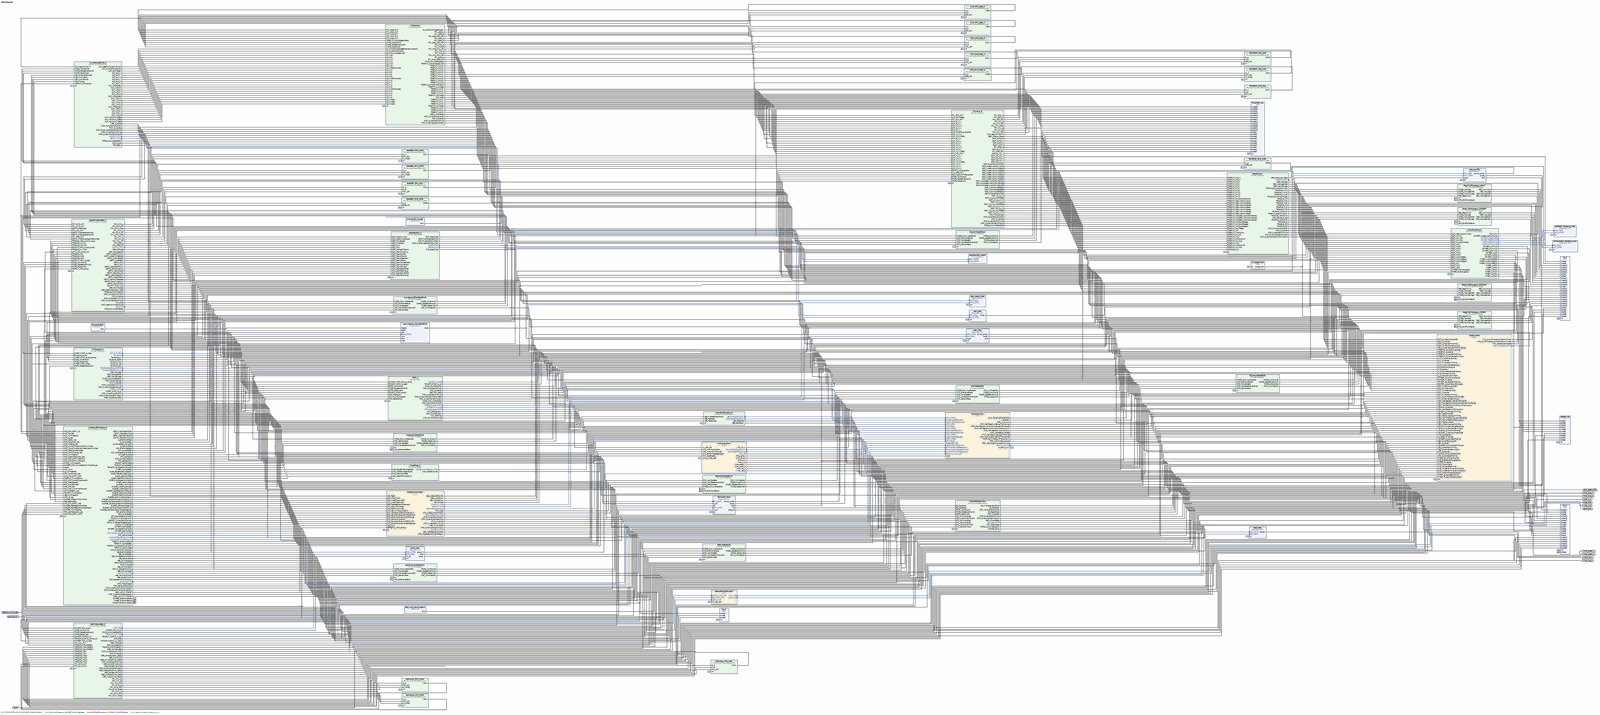
[diagram p0: block diagram of the top level, whole]
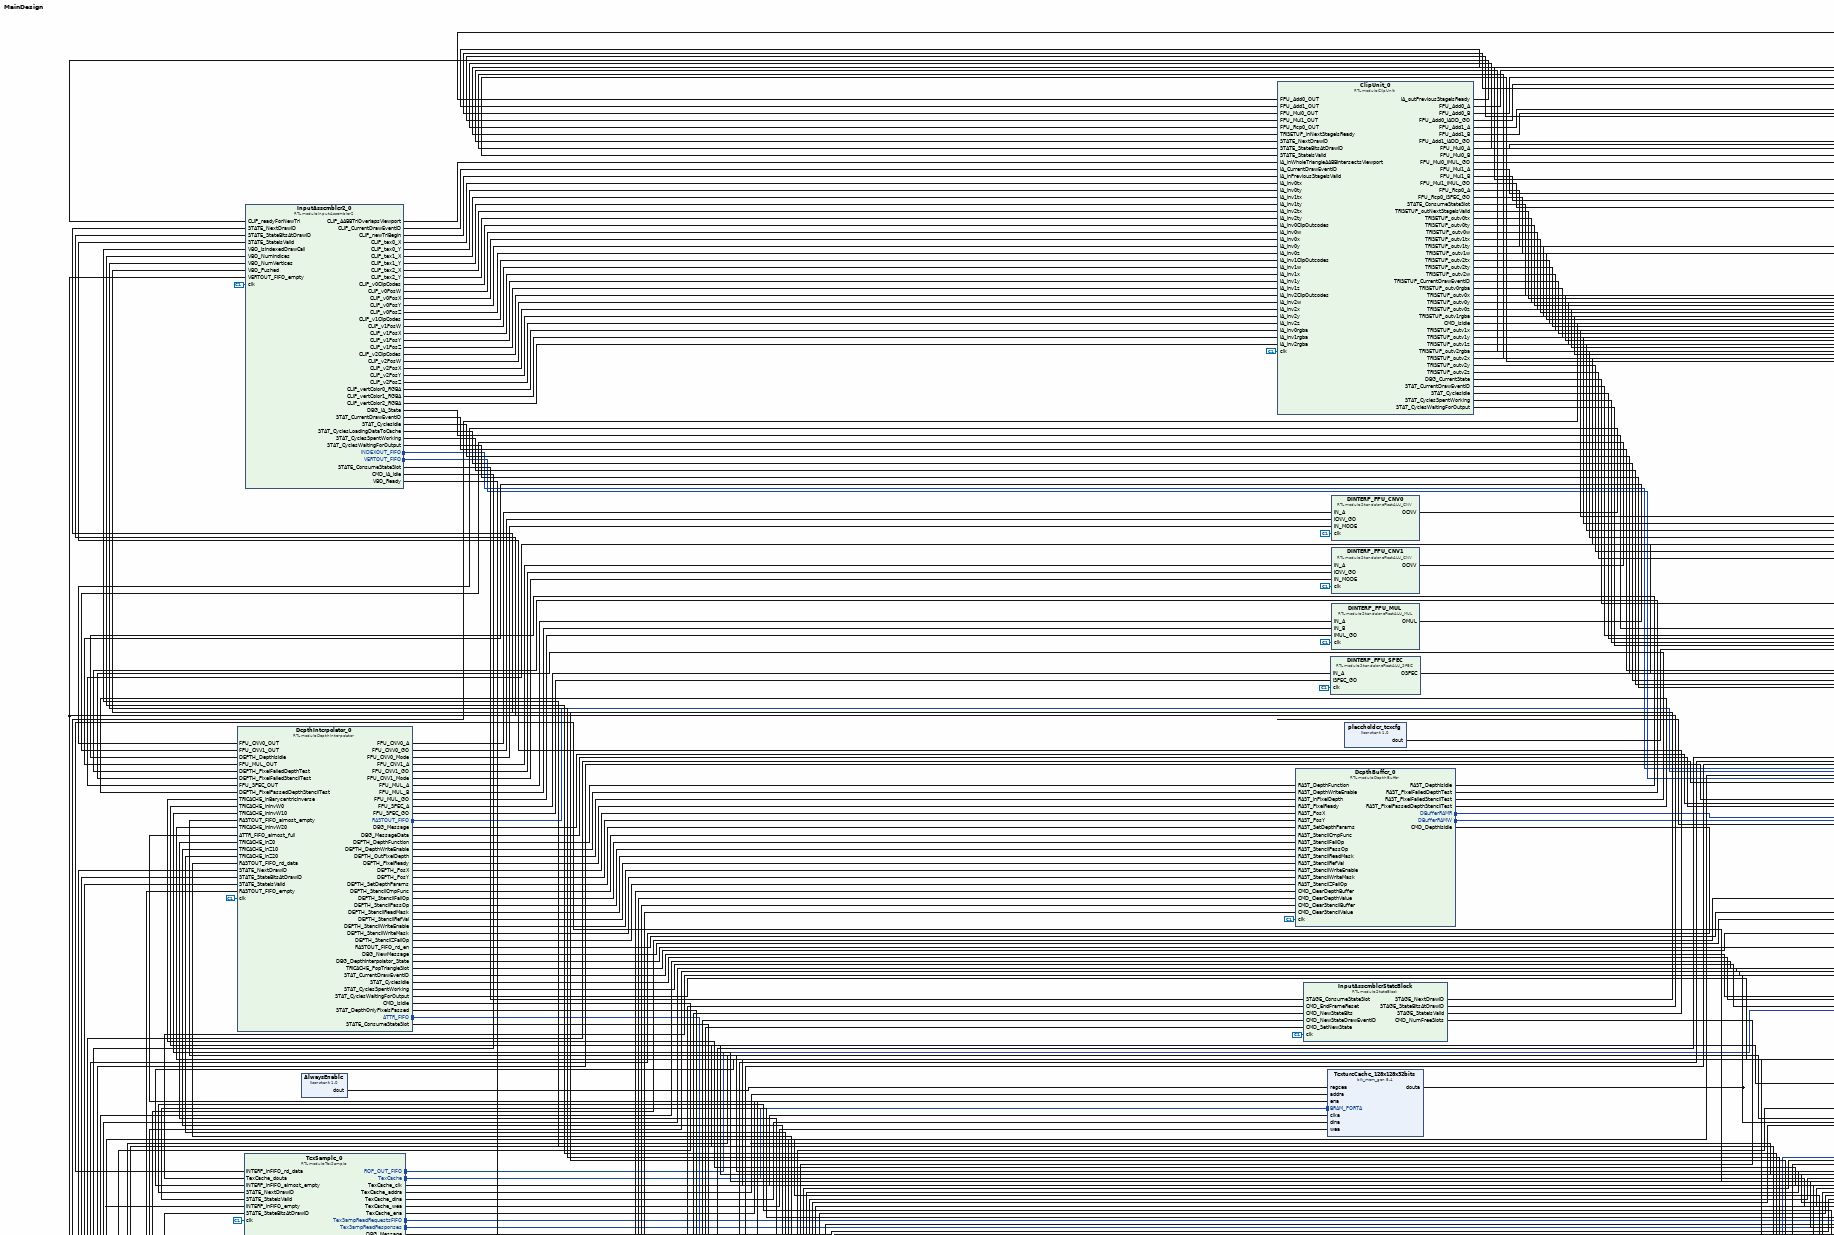
[diagram p1: block diagram of the top level, upper left part]
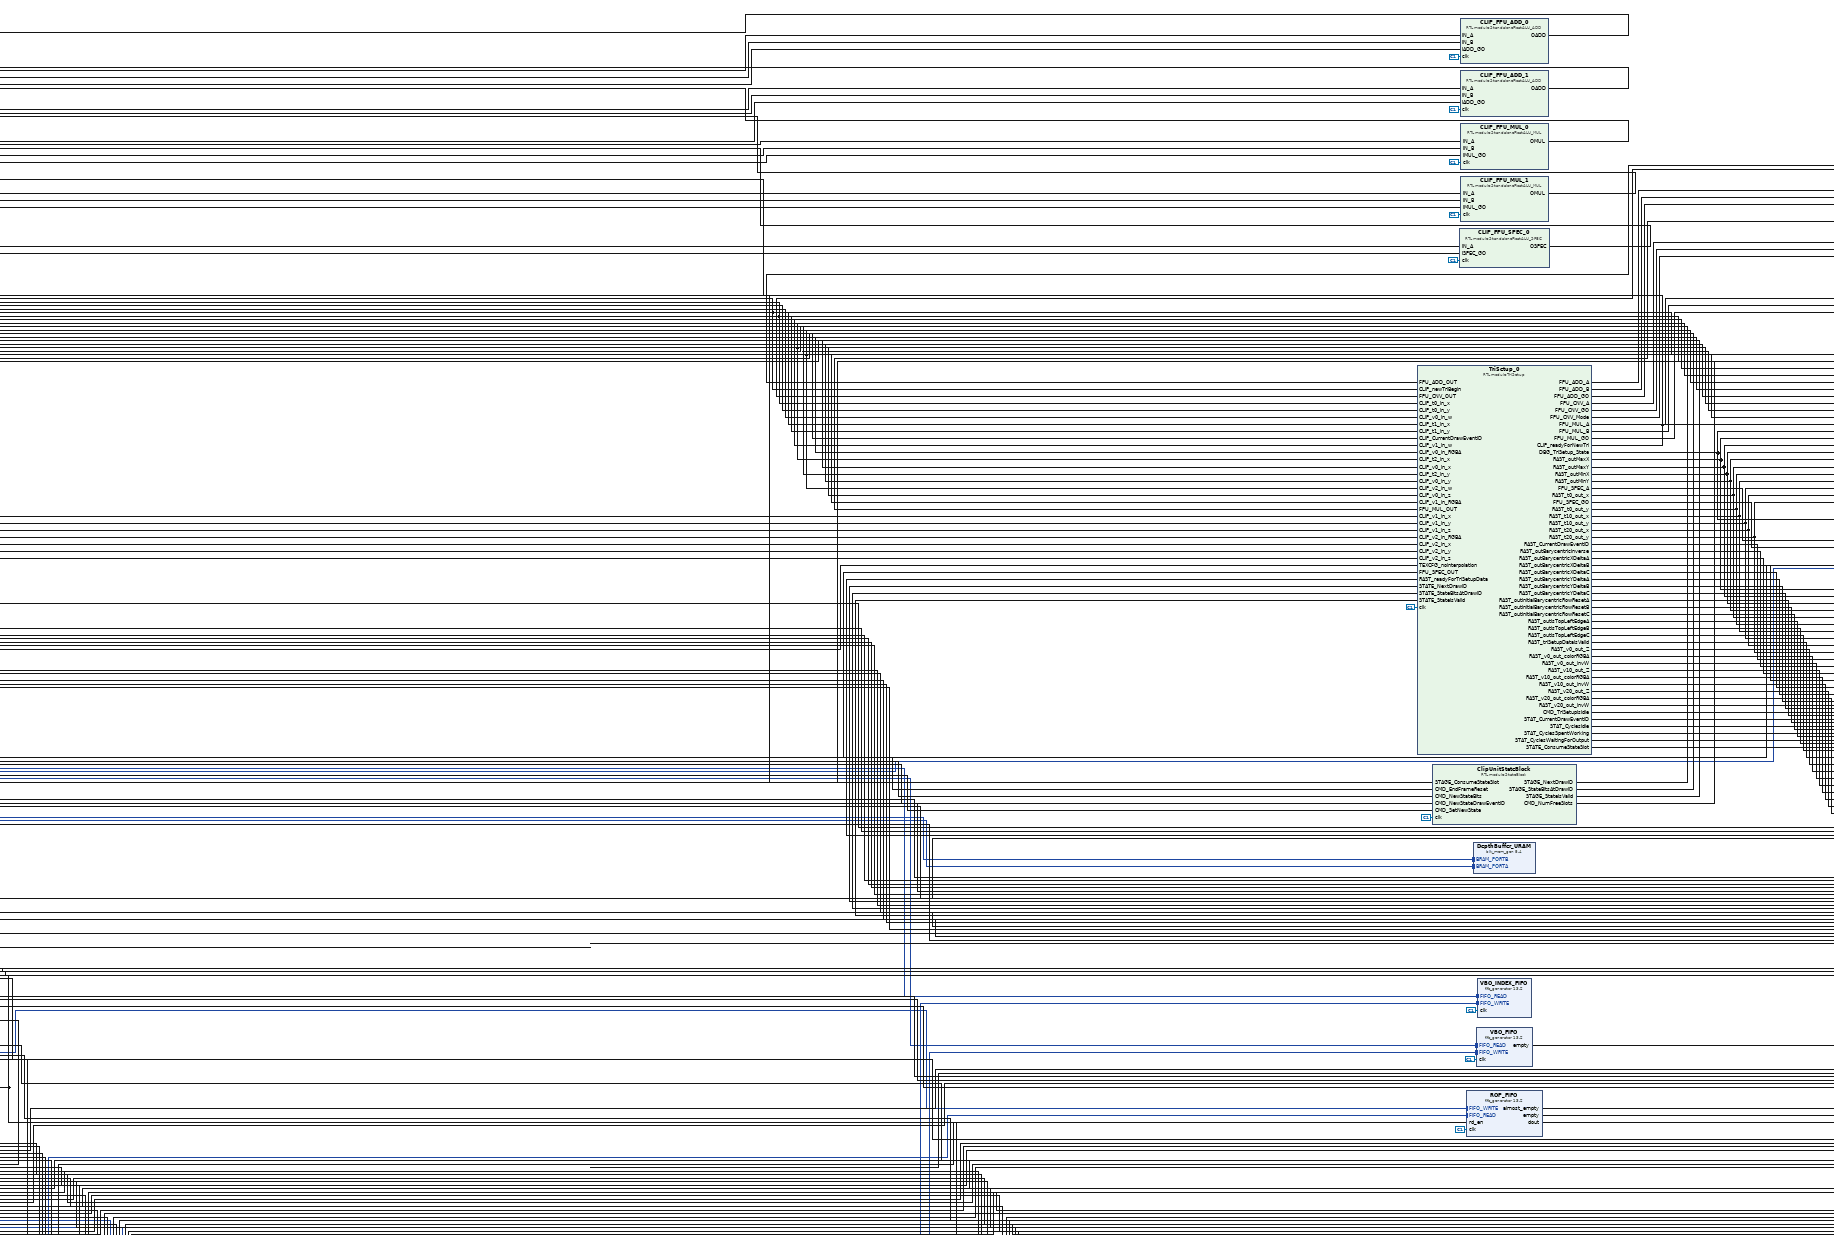
[diagram p2: block diagram of the top level, upper centre part]
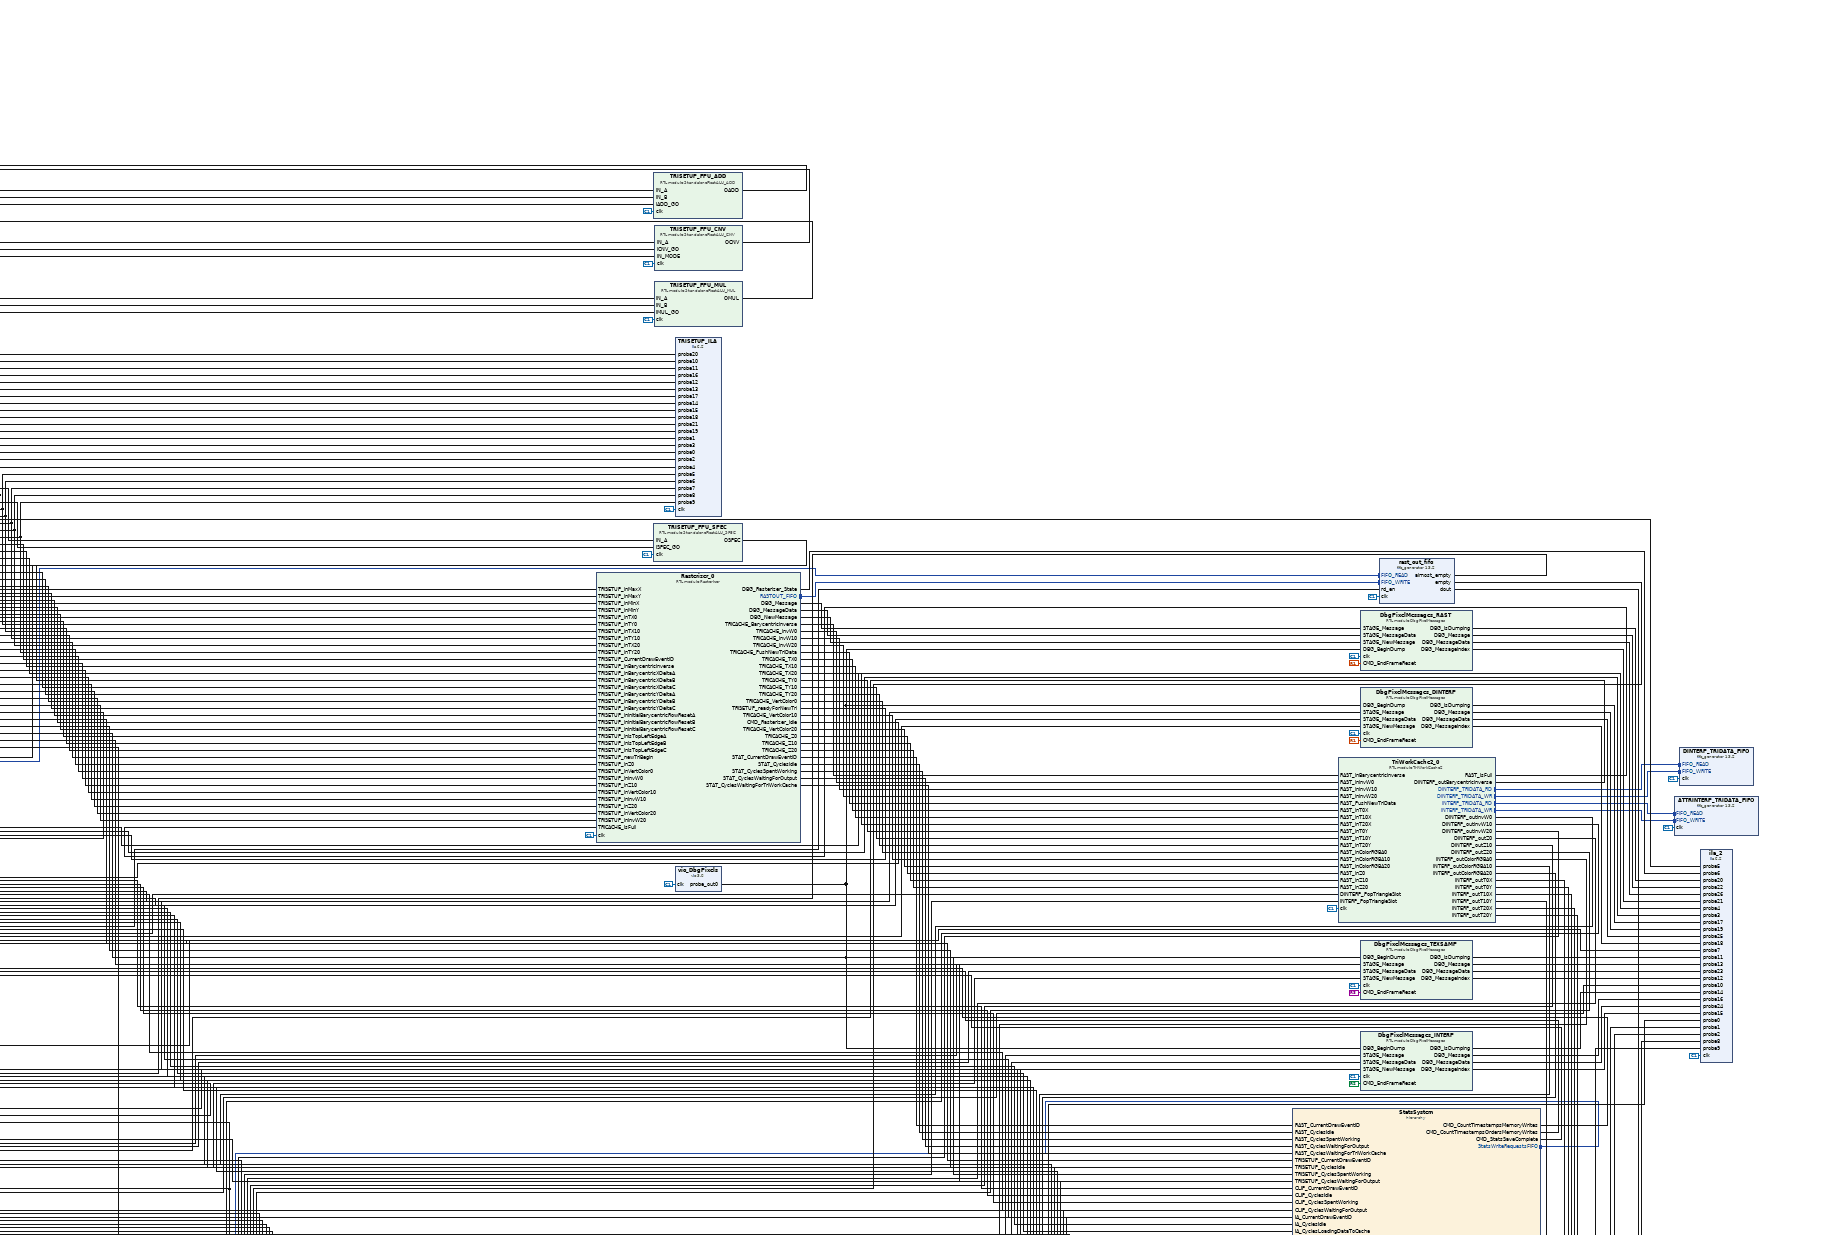
[diagram p3: block diagram of the top level, upper right part]
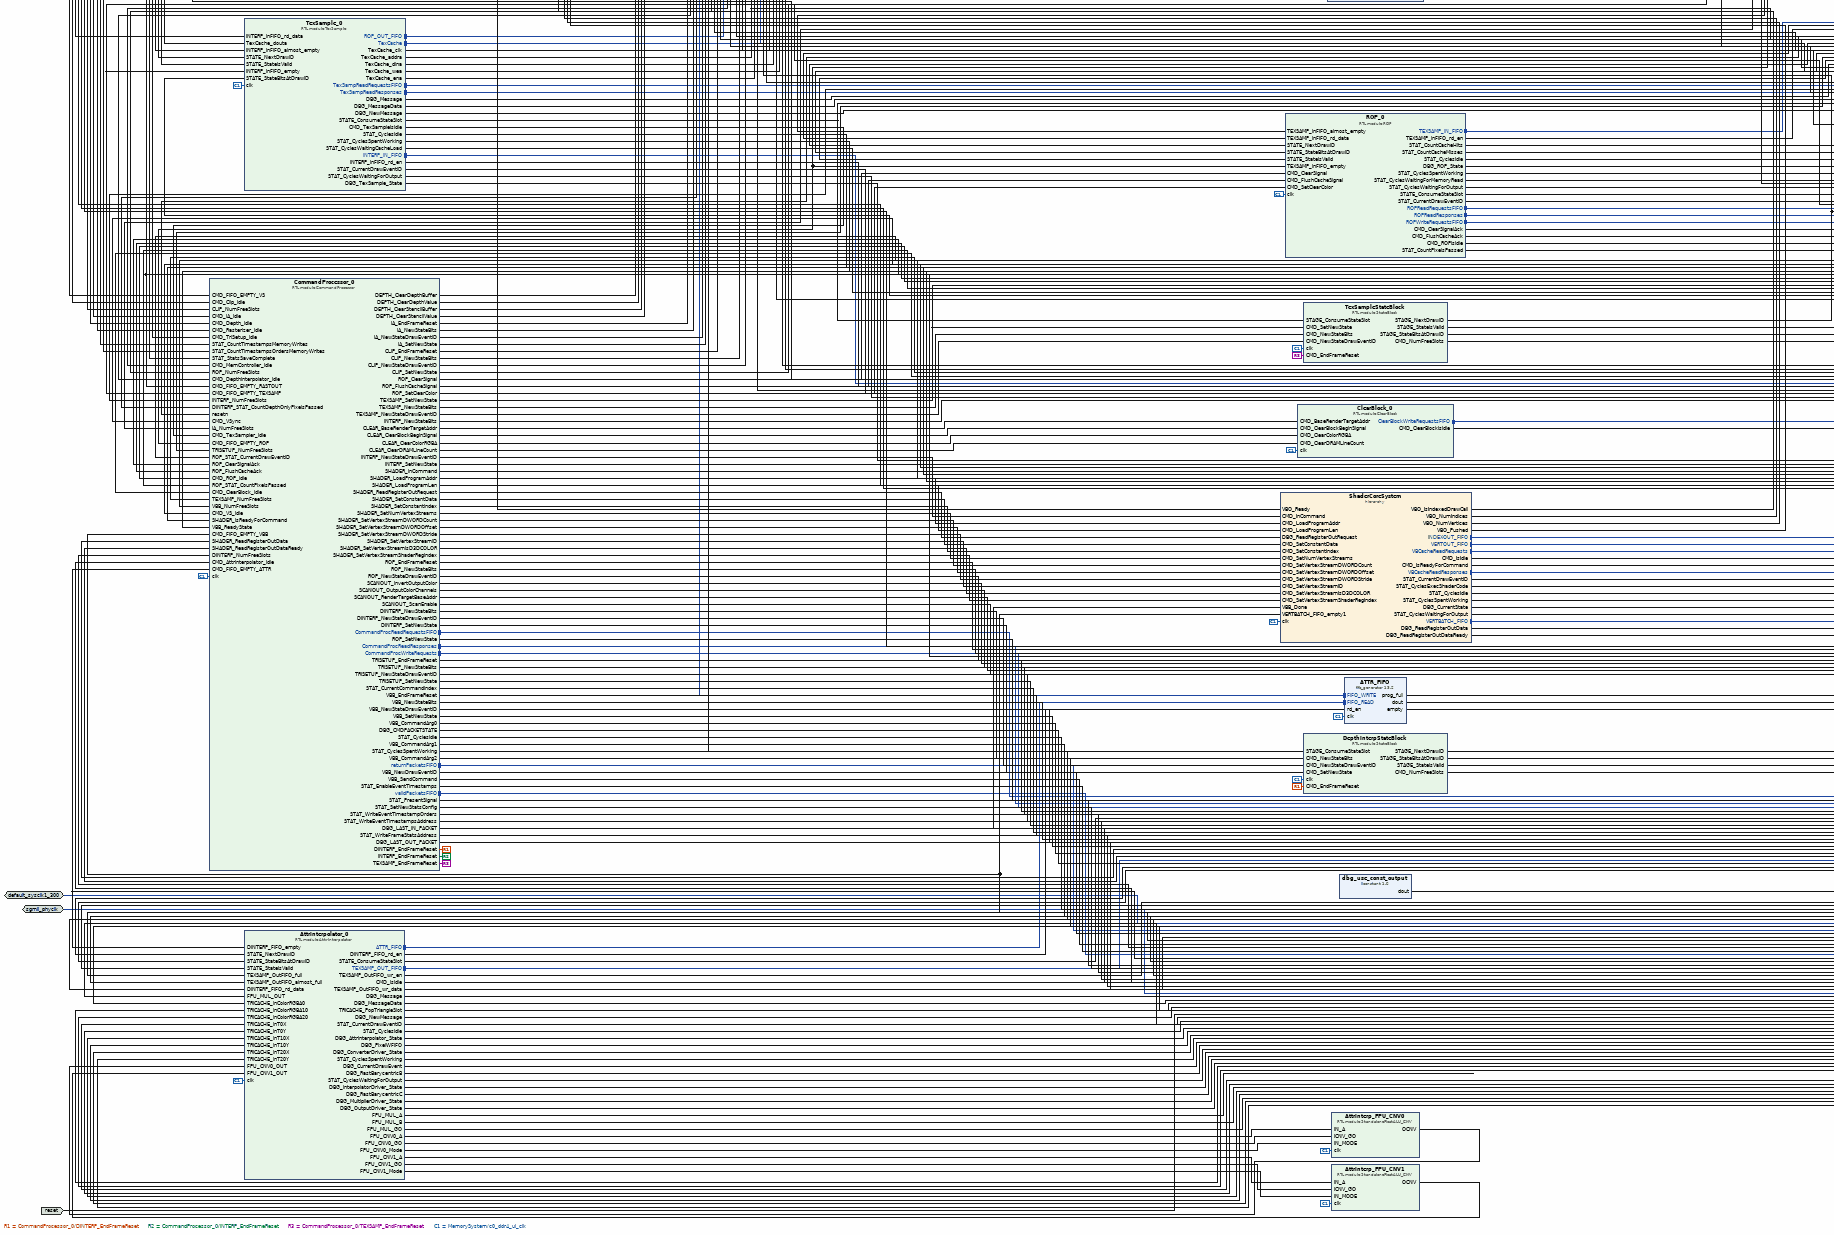
[diagram p4: block diagram of the top level, lower left part]
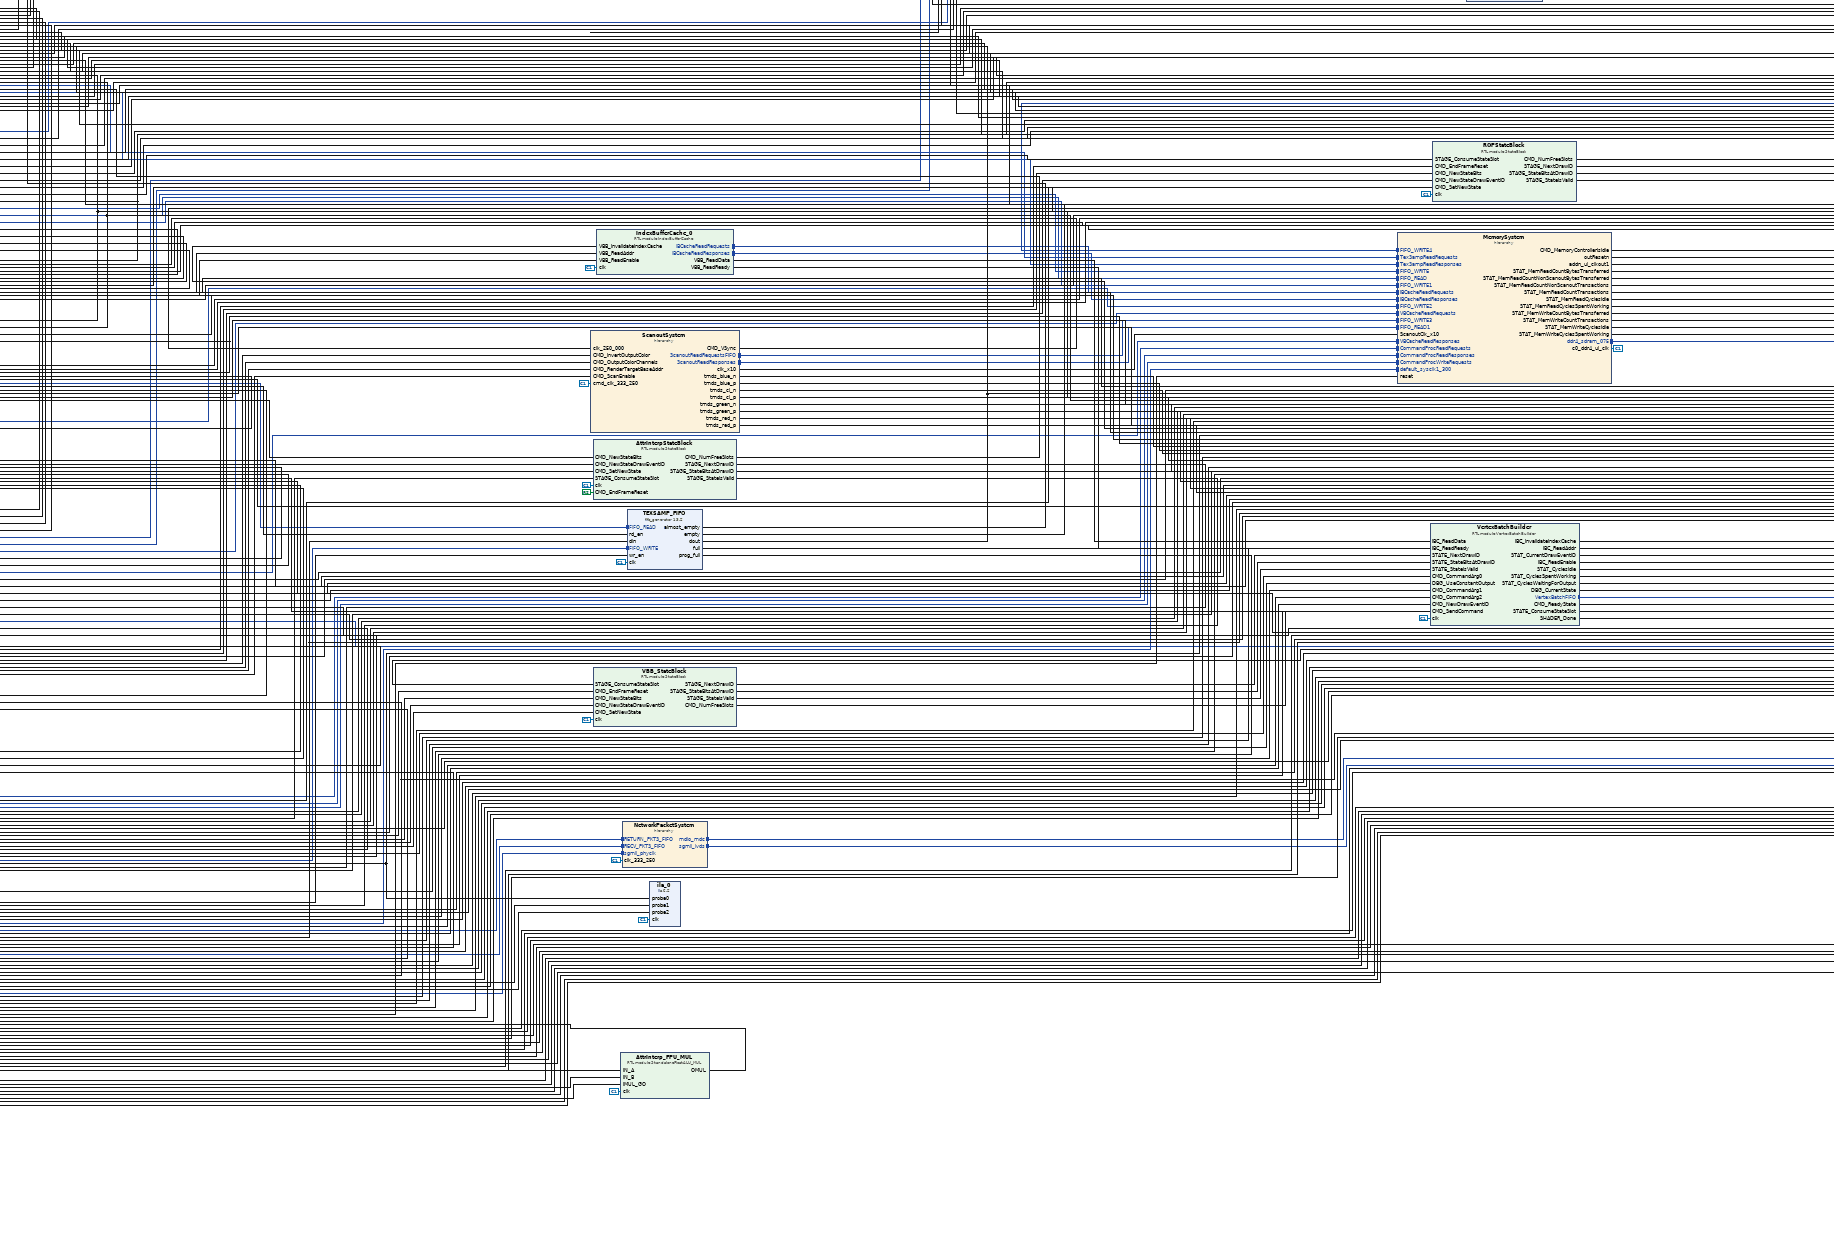
[diagram p5: block diagram of the top level, lower centre part]
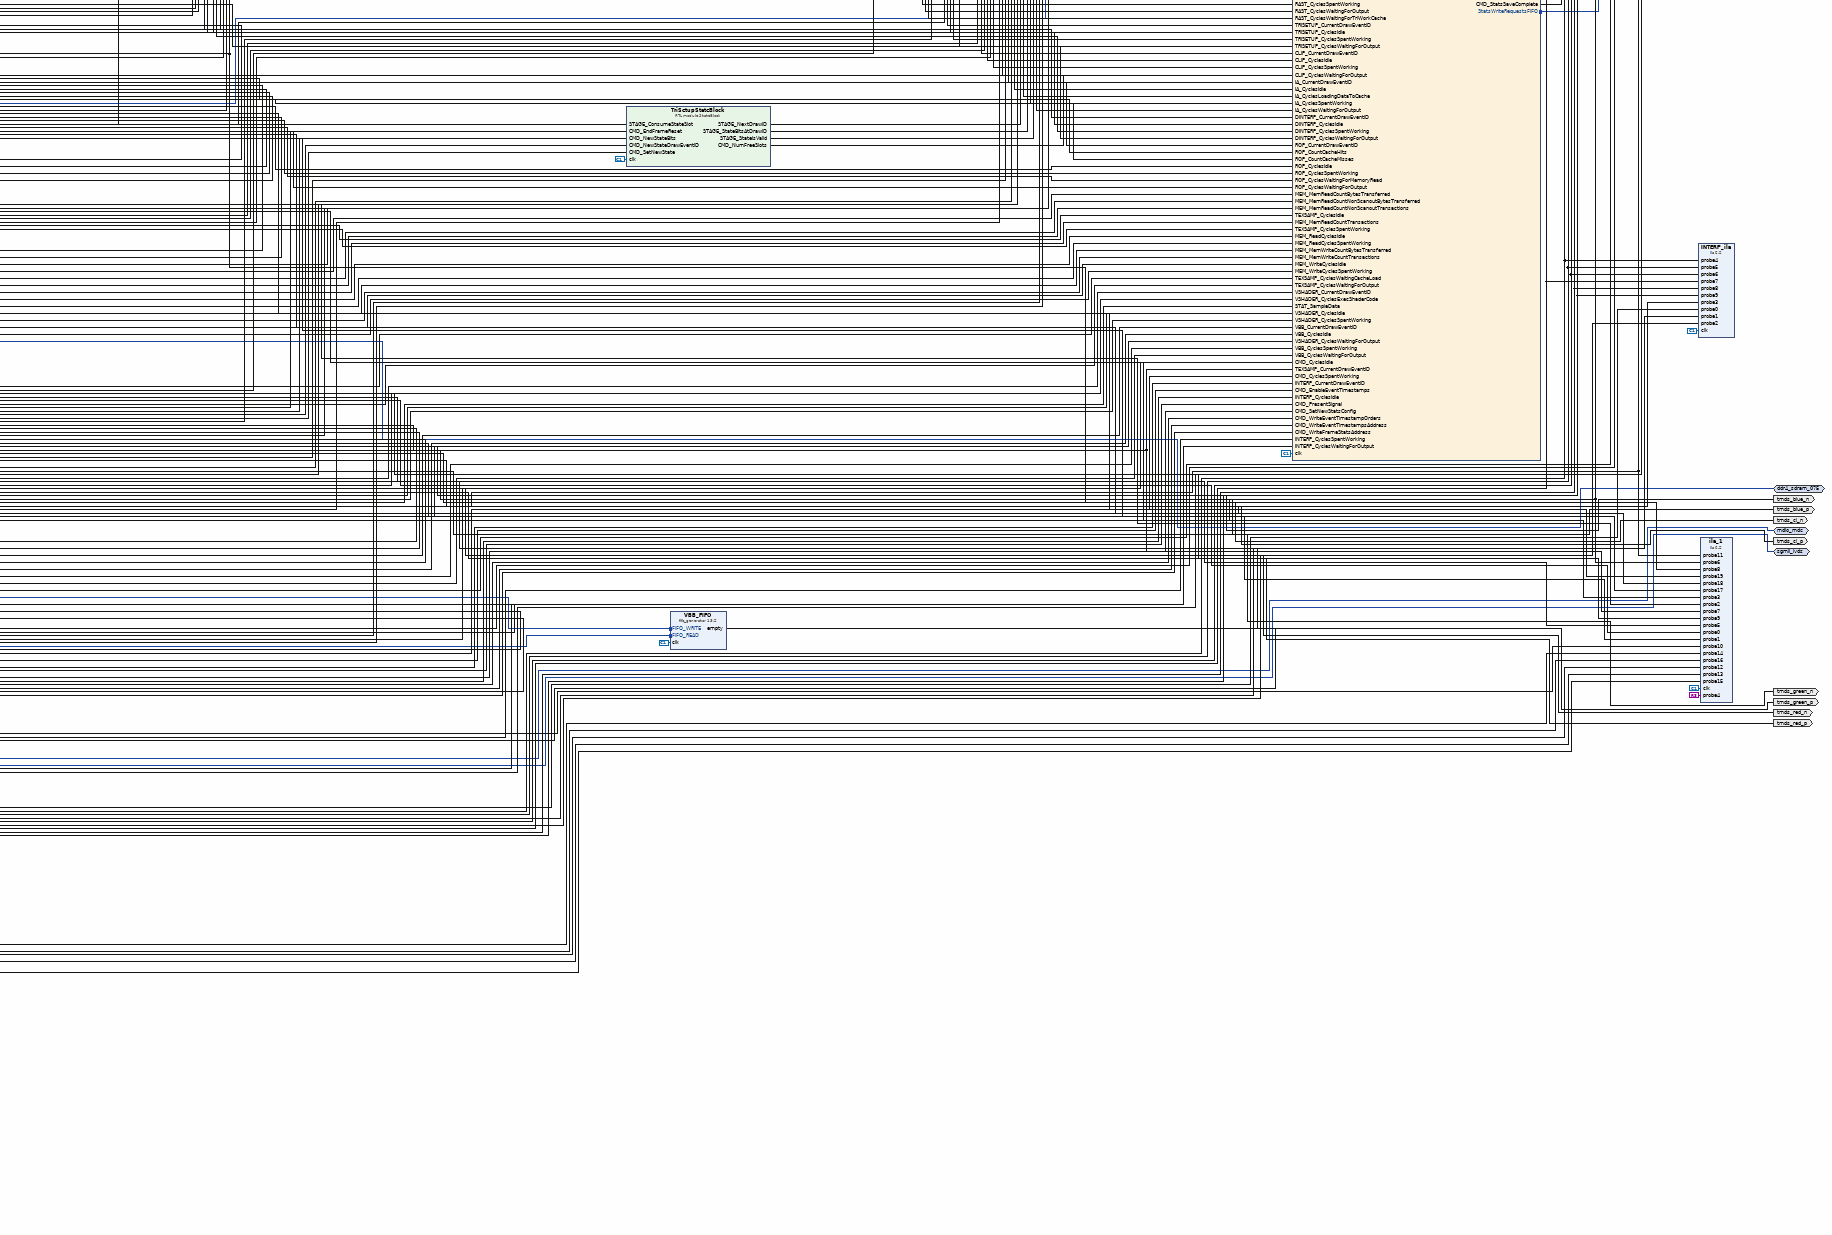
[diagram p6: block diagram of the top level, lower right part]
# Vivado block design MainDesign, xcku5p-ffvb676-2-e, Vivado 2025.2
create_bd_design MainDesign

create_bd_intf_port -mode Slave -vlnv xilinx.com:interface:diff_clock_rtl:1.0 default_sysclk1_300
set_property -dict {CONFIG.FREQ_HZ 300000000} [get_bd_intf_ports default_sysclk1_300]
create_bd_intf_port -mode Master -vlnv xilinx.com:interface:ddr4_rtl:1.0 ddr4_sdram_075
create_bd_intf_port -mode Master -vlnv xilinx.com:interface:mdio_rtl:1.0 mdio_mdc
create_bd_intf_port -mode Master -vlnv xilinx.com:interface:sgmii_rtl:1.0 sgmii_lvds
create_bd_intf_port -mode Slave -vlnv xilinx.com:interface:diff_clock_rtl:1.0 sgmii_phyclk
set_property -dict {CONFIG.FREQ_HZ 625000000} [get_bd_intf_ports sgmii_phyclk]
create_bd_port -dir I -type rst reset
set_property -dict {CONFIG.POLARITY ACTIVE_HIGH} [get_bd_ports reset]
create_bd_port -dir O tmds_blue_p
create_bd_port -dir O tmds_blue_n
create_bd_port -dir O tmds_green_p
create_bd_port -dir O tmds_green_n
create_bd_port -dir O tmds_red_p
create_bd_port -dir O tmds_red_n
create_bd_port -dir O tmds_cl_p
create_bd_port -dir O tmds_cl_n

create_bd_cell -type module -reference CommandProcessor CommandProcessor_0
create_bd_cell -type hier MemorySystem
create_bd_cell -type module -reference VertexBatchBuilder VertexBatchBuilder
create_bd_cell -type module -reference StateBlock VBB_StateBlock
set_property -dict {CONFIG.StateBitsCount 35} [get_bd_cells VBB_StateBlock]
create_bd_cell -type inline_hdl -vlnv xilinx.com:inline_hdl:ilconstant:1.0 dbg_use_const_output
set_property -dict {CONFIG.CONST_VAL 0} [get_bd_cells dbg_use_const_output]
create_bd_cell -type ip -vlnv xilinx.com:ip:fifo_generator:13.2 VBB_FIFO
set_property -dict [list \
  CONFIG.Input_Data_Width 544 \
  CONFIG.Input_Depth 512 \
  CONFIG.Performance_Options First_Word_Fall_Through \
  CONFIG.Use_Embedded_Registers false \
] [get_bd_cells VBB_FIFO]
create_bd_cell -type module -reference IndexBufferCache IndexBufferCache_0
create_bd_cell -type hier ShaderCoreSystem
create_bd_cell -type ip -vlnv xilinx.com:ip:fifo_generator:13.2 VBO_FIFO
set_property -dict [list \
  CONFIG.Input_Data_Width 320 \
  CONFIG.Input_Depth 512 \
  CONFIG.Performance_Options First_Word_Fall_Through \
  CONFIG.Use_Embedded_Registers false \
] [get_bd_cells VBO_FIFO]
create_bd_cell -type ip -vlnv xilinx.com:ip:fifo_generator:13.2 VBO_INDEX_FIFO
set_property -dict [list \
  CONFIG.Input_Data_Width 272 \
  CONFIG.Input_Depth 512 \
  CONFIG.Performance_Options First_Word_Fall_Through \
  CONFIG.Use_Embedded_Registers false \
] [get_bd_cells VBO_INDEX_FIFO]
create_bd_cell -type module -reference InputAssembler2 InputAssembler2_0
create_bd_cell -type module -reference StateBlock InputAssemblerStateBlock
set_property -dict {CONFIG.StateBitsCount 5} [get_bd_cells InputAssemblerStateBlock]
create_bd_cell -type module -reference ClipUnit ClipUnit_0
create_bd_cell -type module -reference StateBlock ClipUnitStateBlock
set_property -dict {CONFIG.StateBitsCount 11} [get_bd_cells ClipUnitStateBlock]
create_bd_cell -type module -reference StandaloneFloatALU_ADD CLIP_FPU_ADD_0
create_bd_cell -type module -reference StandaloneFloatALU_ADD CLIP_FPU_ADD_1
create_bd_cell -type module -reference StandaloneFloatALU_MUL CLIP_FPU_MUL_0
create_bd_cell -type module -reference StandaloneFloatALU_MUL CLIP_FPU_MUL_1
create_bd_cell -type module -reference StandaloneFloatALU_SPEC CLIP_FPU_SPEC_0
create_bd_cell -type module -reference TriSetup TriSetup_0
create_bd_cell -type module -reference StateBlock TriSetupStateBlock
set_property -dict {CONFIG.StateBitsCount 192} [get_bd_cells TriSetupStateBlock]
create_bd_cell -type module -reference StandaloneFloatALU_ADD TRISETUP_FPU_ADD
create_bd_cell -type module -reference StandaloneFloatALU_MUL TRISETUP_FPU_MUL
create_bd_cell -type module -reference StandaloneFloatALU_SPEC TRISETUP_FPU_SPEC
create_bd_cell -type module -reference StandaloneFloatALU_CNV TRISETUP_FPU_CNV
create_bd_cell -type inline_hdl -vlnv xilinx.com:inline_hdl:ilconstant:1.0 placeholder_texcfg
set_property -dict {CONFIG.CONST_VAL 0} [get_bd_cells placeholder_texcfg]
create_bd_cell -type module -reference Rasterizer Rasterizer_0
create_bd_cell -type ip -vlnv xilinx.com:ip:fifo_generator:13.2 rast_out_fifo
set_property -dict [list \
  CONFIG.Almost_Empty_Flag true \
  CONFIG.Almost_Full_Flag true \
  CONFIG.Fifo_Implementation Common_Clock_Block_RAM \
  CONFIG.Input_Data_Width 96 \
  CONFIG.Input_Depth 512 \
  CONFIG.Performance_Options First_Word_Fall_Through \
  CONFIG.Programmable_Full_Type No_Programmable_Full_Threshold \
  CONFIG.Reset_Pin false \
  CONFIG.Use_Embedded_Registers false \
] [get_bd_cells rast_out_fifo]
create_bd_cell -type module -reference TriWorkCache2 TriWorkCache2_0
create_bd_cell -type ip -vlnv xilinx.com:ip:fifo_generator:13.2 DINTERP_TRIDATA_FIFO
set_property -dict [list \
  CONFIG.Input_Data_Width 224 \
  CONFIG.Input_Depth 512 \
  CONFIG.Performance_Options First_Word_Fall_Through \
  CONFIG.Use_Embedded_Registers false \
] [get_bd_cells DINTERP_TRIDATA_FIFO]
create_bd_cell -type ip -vlnv xilinx.com:ip:fifo_generator:13.2 ATTRINTERP_TRIDATA_FIFO
set_property -dict [list \
  CONFIG.Input_Data_Width 576 \
  CONFIG.Input_Depth 512 \
  CONFIG.Performance_Options First_Word_Fall_Through \
  CONFIG.Use_Embedded_Registers false \
] [get_bd_cells ATTRINTERP_TRIDATA_FIFO]
create_bd_cell -type module -reference DepthInterpolator DepthInterpolator_0
create_bd_cell -type module -reference StateBlock DepthInterpStateBlock
set_property -dict {CONFIG.StateBitsCount 77} [get_bd_cells DepthInterpStateBlock]
create_bd_cell -type module -reference StandaloneFloatALU_MUL DINTERP_FPU_MUL
create_bd_cell -type module -reference StandaloneFloatALU_CNV DINTERP_FPU_CNV0
create_bd_cell -type module -reference StandaloneFloatALU_CNV DINTERP_FPU_CNV1
create_bd_cell -type module -reference StandaloneFloatALU_SPEC DINTERP_FPU_SPEC
create_bd_cell -type module -reference DepthBuffer DepthBuffer_0
create_bd_cell -type ip -vlnv xilinx.com:ip:blk_mem_gen:8.4 DepthBuffer_URAM
set_property -dict [list \
  CONFIG.Byte_Size 8 \
  CONFIG.Memory_Type Simple_Dual_Port_RAM \
  CONFIG.Operating_Mode_A WRITE_FIRST \
  CONFIG.PRIM_type_to_Implement URAM \
  CONFIG.READ_LATENCY_B 3 \
  CONFIG.Use_Byte_Write_Enable true \
  CONFIG.Write_Depth_A 153600 \
  CONFIG.Write_Width_A 64 \
  CONFIG.use_bram_block Stand_Alone \
] [get_bd_cells DepthBuffer_URAM]
create_bd_cell -type ip -vlnv xilinx.com:ip:fifo_generator:13.2 ATTR_FIFO
set_property -dict [list \
  CONFIG.Full_Threshold_Assert_Value 450 \
  CONFIG.Input_Data_Width 128 \
  CONFIG.Input_Depth 512 \
  CONFIG.Performance_Options First_Word_Fall_Through \
  CONFIG.Programmable_Full_Type Single_Programmable_Full_Threshold_Constant \
  CONFIG.Use_Embedded_Registers false \
] [get_bd_cells ATTR_FIFO]
create_bd_cell -type module -reference AttrInterpolator AttrInterpolator_0
create_bd_cell -type module -reference StateBlock AttrInterpStateBlock
set_property -dict {CONFIG.StateBitsCount 7} [get_bd_cells AttrInterpStateBlock]
create_bd_cell -type module -reference StandaloneFloatALU_MUL AttrInterp_FPU_MUL
create_bd_cell -type module -reference StandaloneFloatALU_CNV AttrInterp_FPU_CNV0
create_bd_cell -type module -reference StandaloneFloatALU_CNV AttrInterp_FPU_CNV1
create_bd_cell -type ip -vlnv xilinx.com:ip:fifo_generator:13.2 TEXSAMP_FIFO
set_property -dict [list \
  CONFIG.Almost_Empty_Flag true \
  CONFIG.Almost_Full_Flag true \
  CONFIG.Fifo_Implementation Common_Clock_Block_RAM \
  CONFIG.Full_Threshold_Assert_Value 450 \
  CONFIG.Input_Data_Width 96 \
  CONFIG.Input_Depth 512 \
  CONFIG.Performance_Options First_Word_Fall_Through \
  CONFIG.Programmable_Full_Type Single_Programmable_Full_Threshold_Constant \
  CONFIG.Reset_Pin false \
  CONFIG.Use_Embedded_Registers false \
] [get_bd_cells TEXSAMP_FIFO]
create_bd_cell -type module -reference TexSample TexSample_0
create_bd_cell -type ip -vlnv xilinx.com:ip:blk_mem_gen:8.4 TextureCache_128x128x32bits
set_property -dict [list \
  CONFIG.Operating_Mode_A NO_CHANGE \
  CONFIG.PRIM_type_to_Implement BRAM \
  CONFIG.Use_REGCEA_Pin true \
  CONFIG.Use_RSTA_Pin false \
  CONFIG.Write_Depth_A 16384 \
  CONFIG.use_bram_block Stand_Alone \
] [get_bd_cells TextureCache_128x128x32bits]
create_bd_cell -type module -reference StateBlock TexSampleStateBlock
set_property -dict {CONFIG.StateBitsCount 74} [get_bd_cells TexSampleStateBlock]
create_bd_cell -type ip -vlnv xilinx.com:ip:fifo_generator:13.2 ROP_FIFO
set_property -dict [list \
  CONFIG.Almost_Empty_Flag true \
  CONFIG.Almost_Full_Flag true \
  CONFIG.Fifo_Implementation Common_Clock_Block_RAM \
  CONFIG.Input_Data_Width 64 \
  CONFIG.Input_Depth 512 \
  CONFIG.Performance_Options First_Word_Fall_Through \
  CONFIG.Reset_Pin false \
  CONFIG.Use_Embedded_Registers false \
] [get_bd_cells ROP_FIFO]
create_bd_cell -type module -reference ROP ROP_0
create_bd_cell -type module -reference StateBlock ROPStateBlock
set_property -dict {CONFIG.StateBitsCount 101} [get_bd_cells ROPStateBlock]
create_bd_cell -type module -reference ClearBlock ClearBlock_0
create_bd_cell -type hier ScanoutSystem
create_bd_cell -type hier StatsSystem
create_bd_cell -type hier NetworkPacketSystem
create_bd_cell -type ip -vlnv xilinx.com:ip:ila:6.2 ila_0
set_property -dict [list \
  CONFIG.C_MONITOR_TYPE Native \
  CONFIG.C_NUM_OF_PROBES 3 \
  CONFIG.C_PROBE0_WIDTH 8 \
  CONFIG.C_PROBE1_WIDTH 88 \
  CONFIG.C_PROBE2_WIDTH 88 \
] [get_bd_cells ila_0]
create_bd_cell -type ip -vlnv xilinx.com:ip:ila:6.2 ila_1
set_property -dict [list \
  CONFIG.C_MONITOR_TYPE Native \
  CONFIG.C_NUM_OF_PROBES 20 \
  CONFIG.C_PROBE10_WIDTH 128 \
  CONFIG.C_PROBE11_WIDTH 96 \
  CONFIG.C_PROBE12_WIDTH 3 \
  CONFIG.C_PROBE13_WIDTH 3 \
  CONFIG.C_PROBE14_WIDTH 3 \
  CONFIG.C_PROBE15_WIDTH 3 \
  CONFIG.C_PROBE16_WIDTH 16 \
  CONFIG.C_PROBE18_WIDTH 14 \
  CONFIG.C_PROBE19_WIDTH 32 \
  CONFIG.C_PROBE1_WIDTH 3 \
  CONFIG.C_PROBE5_WIDTH 16 \
  CONFIG.C_PROBE6_WIDTH 6 \
  CONFIG.C_PROBE7_WIDTH 16 \
  CONFIG.C_PROBE8_WIDTH 64 \
  CONFIG.C_PROBE9_WIDTH 96 \
] [get_bd_cells ila_1]
create_bd_cell -type ip -vlnv xilinx.com:ip:ila:6.2 ila_2
set_property -dict [list \
  CONFIG.C_MONITOR_TYPE Native \
  CONFIG.C_NUM_OF_PROBES 27 \
  CONFIG.C_PROBE0_WIDTH 8 \
  CONFIG.C_PROBE10_WIDTH 5 \
  CONFIG.C_PROBE12_WIDTH 8 \
  CONFIG.C_PROBE13_WIDTH 16 \
  CONFIG.C_PROBE15_WIDTH 8 \
  CONFIG.C_PROBE16_WIDTH 16 \
  CONFIG.C_PROBE18_WIDTH 8 \
  CONFIG.C_PROBE19_WIDTH 16 \
  CONFIG.C_PROBE1_WIDTH 4 \
  CONFIG.C_PROBE21_WIDTH 8 \
  CONFIG.C_PROBE22_WIDTH 16 \
  CONFIG.C_PROBE23_WIDTH 16 \
  CONFIG.C_PROBE24_WIDTH 16 \
  CONFIG.C_PROBE25_WIDTH 16 \
  CONFIG.C_PROBE26_WIDTH 16 \
  CONFIG.C_PROBE2_WIDTH 6 \
  CONFIG.C_PROBE3_WIDTH 6 \
  CONFIG.C_PROBE4_WIDTH 8 \
  CONFIG.C_PROBE5_WIDTH 8 \
  CONFIG.C_PROBE6_WIDTH 4 \
  CONFIG.C_PROBE7_WIDTH 7 \
  CONFIG.C_PROBE8_WIDTH 3 \
  CONFIG.C_PROBE9_WIDTH 6 \
] [get_bd_cells ila_2]
create_bd_cell -type module -reference DbgPixelMessages DbgPixelMessages_RAST
create_bd_cell -type module -reference DbgPixelMessages DbgPixelMessages_DINTERP
create_bd_cell -type module -reference DbgPixelMessages DbgPixelMessages_INTERP
create_bd_cell -type module -reference DbgPixelMessages DbgPixelMessages_TEXSAMP
create_bd_cell -type ip -vlnv xilinx.com:ip:vio:3.0 vio_DbgPixels
set_property -dict {CONFIG.C_NUM_PROBE_IN 0} [get_bd_cells vio_DbgPixels]
create_bd_cell -type ip -vlnv xilinx.com:ip:ila:6.2 INTERP_ila
set_property -dict [list \
  CONFIG.C_MONITOR_TYPE Native \
  CONFIG.C_NUM_OF_PROBES 10 \
  CONFIG.C_PROBE0_WIDTH 32 \
  CONFIG.C_PROBE1_WIDTH 32 \
  CONFIG.C_PROBE2_WIDTH 32 \
  CONFIG.C_PROBE3_WIDTH 96 \
  CONFIG.C_PROBE4_WIDTH 32 \
  CONFIG.C_PROBE5_WIDTH 32 \
  CONFIG.C_PROBE6_WIDTH 32 \
  CONFIG.C_PROBE7_WIDTH 32 \
  CONFIG.C_PROBE8_WIDTH 32 \
  CONFIG.C_PROBE9_WIDTH 32 \
] [get_bd_cells INTERP_ila]
create_bd_cell -type ip -vlnv xilinx.com:ip:ila:6.2 TRISETUP_ILA
set_property -dict [list \
  CONFIG.C_MONITOR_TYPE Native \
  CONFIG.C_NUM_OF_PROBES 22 \
  CONFIG.C_PROBE0_WIDTH 16 \
  CONFIG.C_PROBE10_WIDTH 32 \
  CONFIG.C_PROBE11_WIDTH 32 \
  CONFIG.C_PROBE12_WIDTH 32 \
  CONFIG.C_PROBE13_WIDTH 32 \
  CONFIG.C_PROBE14_WIDTH 32 \
  CONFIG.C_PROBE15_WIDTH 32 \
  CONFIG.C_PROBE16_WIDTH 32 \
  CONFIG.C_PROBE17_WIDTH 32 \
  CONFIG.C_PROBE18_WIDTH 32 \
  CONFIG.C_PROBE19_WIDTH 8 \
  CONFIG.C_PROBE1_WIDTH 16 \
  CONFIG.C_PROBE2_WIDTH 16 \
  CONFIG.C_PROBE3_WIDTH 16 \
  CONFIG.C_PROBE4_WIDTH 32 \
  CONFIG.C_PROBE5_WIDTH 32 \
  CONFIG.C_PROBE6_WIDTH 32 \
  CONFIG.C_PROBE7_WIDTH 32 \
  CONFIG.C_PROBE8_WIDTH 32 \
  CONFIG.C_PROBE9_WIDTH 32 \
] [get_bd_cells TRISETUP_ILA]
create_bd_cell -type inline_hdl -vlnv xilinx.com:inline_hdl:ilconstant:1.0 AlwaysEnable

# ---- hierarchy /MemorySystem ----
current_bd_instance /MemorySystem
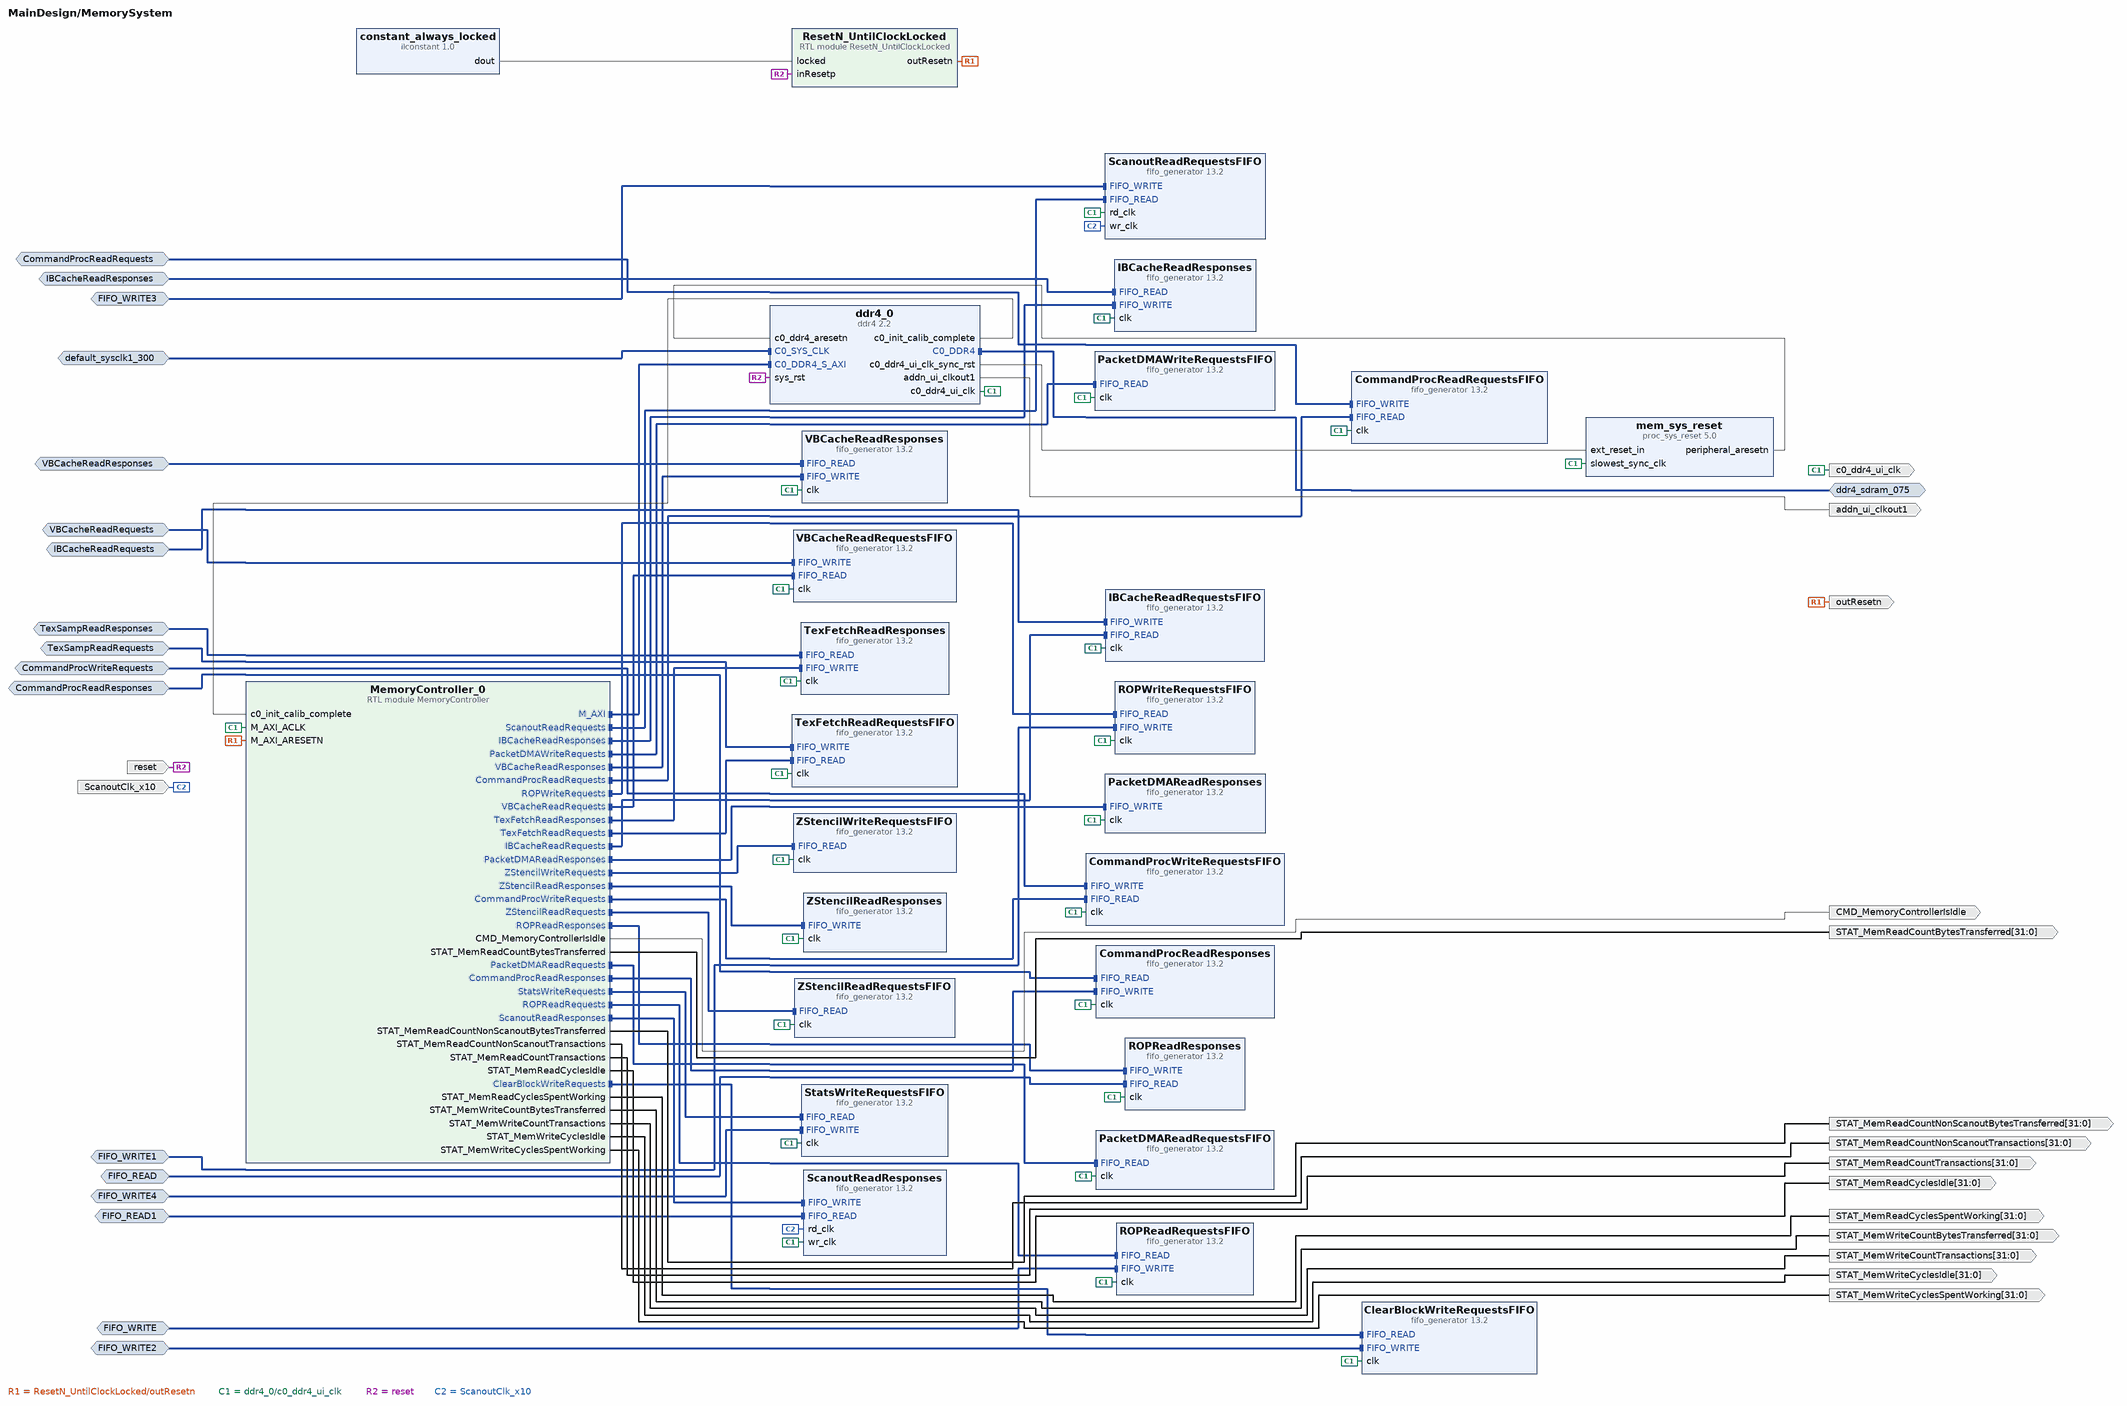
[diagram p7: block diagram inside /MemorySystem]
create_bd_intf_pin -mode Slave -vlnv xilinx.com:interface:fifo_read_rtl:1.0 CommandProcReadResponses
create_bd_intf_pin -mode Slave -vlnv xilinx.com:interface:fifo_write_rtl:1.0 CommandProcReadRequests
create_bd_intf_pin -mode Slave -vlnv xilinx.com:interface:diff_clock_rtl:1.0 default_sysclk1_300
create_bd_intf_pin -mode Master -vlnv xilinx.com:interface:ddr4_rtl:1.0 ddr4_sdram_075
create_bd_intf_pin -mode Slave -vlnv xilinx.com:interface:fifo_write_rtl:1.0 CommandProcWriteRequests
create_bd_intf_pin -mode Slave -vlnv xilinx.com:interface:fifo_write_rtl:1.0 IBCacheReadRequests
create_bd_intf_pin -mode Slave -vlnv xilinx.com:interface:fifo_read_rtl:1.0 IBCacheReadResponses
create_bd_intf_pin -mode Slave -vlnv xilinx.com:interface:fifo_write_rtl:1.0 VBCacheReadRequests
create_bd_intf_pin -mode Slave -vlnv xilinx.com:interface:fifo_read_rtl:1.0 VBCacheReadResponses
create_bd_intf_pin -mode Slave -vlnv xilinx.com:interface:fifo_write_rtl:1.0 TexSampReadRequests
create_bd_intf_pin -mode Slave -vlnv xilinx.com:interface:fifo_read_rtl:1.0 TexSampReadResponses
create_bd_intf_pin -mode Slave -vlnv xilinx.com:interface:fifo_write_rtl:1.0 FIFO_WRITE
create_bd_intf_pin -mode Slave -vlnv xilinx.com:interface:fifo_read_rtl:1.0 FIFO_READ
create_bd_intf_pin -mode Slave -vlnv xilinx.com:interface:fifo_write_rtl:1.0 FIFO_WRITE1
create_bd_intf_pin -mode Slave -vlnv xilinx.com:interface:fifo_write_rtl:1.0 FIFO_WRITE2
create_bd_intf_pin -mode Slave -vlnv xilinx.com:interface:fifo_write_rtl:1.0 FIFO_WRITE3
create_bd_intf_pin -mode Slave -vlnv xilinx.com:interface:fifo_read_rtl:1.0 FIFO_READ1
create_bd_intf_pin -mode Slave -vlnv xilinx.com:interface:fifo_write_rtl:1.0 FIFO_WRITE4
create_bd_pin -dir O -type clk c0_ddr4_ui_clk
create_bd_pin -dir O -type rst outResetn
create_bd_pin -dir O CMD_MemoryControllerIsIdle
create_bd_pin -dir I -type rst reset
create_bd_pin -dir O -type clk addn_ui_clkout1
create_bd_pin -dir I -type clk ScanoutClk_x10
create_bd_pin -dir O -from 31 -to 0 STAT_MemReadCyclesIdle
create_bd_pin -dir O -from 31 -to 0 STAT_MemReadCyclesSpentWorking
create_bd_pin -dir O -from 31 -to 0 STAT_MemWriteCyclesIdle
create_bd_pin -dir O -from 31 -to 0 STAT_MemWriteCyclesSpentWorking
create_bd_pin -dir O -from 31 -to 0 STAT_MemReadCountBytesTransferred
create_bd_pin -dir O -from 31 -to 0 STAT_MemReadCountTransactions
create_bd_pin -dir O -from 31 -to 0 STAT_MemReadCountNonScanoutBytesTransferred
create_bd_pin -dir O -from 31 -to 0 STAT_MemReadCountNonScanoutTransactions
create_bd_pin -dir O -from 31 -to 0 STAT_MemWriteCountBytesTransferred
create_bd_pin -dir O -from 31 -to 0 STAT_MemWriteCountTransactions

create_bd_cell -type ip -vlnv xilinx.com:ip:fifo_generator:13.2 ZStencilReadResponses
set_property -dict [list \
  CONFIG.Fifo_Implementation Common_Clock_Builtin_FIFO \
  CONFIG.Input_Data_Width 256 \
  CONFIG.Input_Depth 512 \
  CONFIG.Performance_Options First_Word_Fall_Through \
  CONFIG.Use_Embedded_Registers true \
] [get_bd_cells ZStencilReadResponses]
create_bd_cell -type ip -vlnv xilinx.com:ip:fifo_generator:13.2 ScanoutReadResponses
set_property -dict [list \
  CONFIG.Fifo_Implementation Independent_Clocks_Builtin_FIFO \
  CONFIG.Input_Data_Width 256 \
  CONFIG.Input_Depth 512 \
  CONFIG.Performance_Options First_Word_Fall_Through \
  CONFIG.Read_Clock_Frequency 250 \
  CONFIG.Use_Embedded_Registers true \
  CONFIG.Write_Clock_Frequency 333 \
] [get_bd_cells ScanoutReadResponses]
create_bd_cell -type ip -vlnv xilinx.com:ip:fifo_generator:13.2 IBCacheReadResponses
set_property -dict [list \
  CONFIG.Fifo_Implementation Common_Clock_Builtin_FIFO \
  CONFIG.Input_Data_Width 256 \
  CONFIG.Input_Depth 512 \
  CONFIG.Performance_Options First_Word_Fall_Through \
  CONFIG.Use_Embedded_Registers true \
] [get_bd_cells IBCacheReadResponses]
create_bd_cell -type ip -vlnv xilinx.com:ip:fifo_generator:13.2 PacketDMAReadRequestsFIFO
set_property -dict [list \
  CONFIG.Fifo_Implementation Common_Clock_Builtin_FIFO \
  CONFIG.Input_Data_Width 30 \
  CONFIG.Input_Depth 512 \
  CONFIG.Performance_Options First_Word_Fall_Through \
  CONFIG.Use_Embedded_Registers true \
] [get_bd_cells PacketDMAReadRequestsFIFO]
create_bd_cell -type ip -vlnv xilinx.com:ip:fifo_generator:13.2 CommandProcReadResponses
set_property -dict [list \
  CONFIG.Fifo_Implementation Common_Clock_Builtin_FIFO \
  CONFIG.Input_Data_Width 256 \
  CONFIG.Input_Depth 512 \
  CONFIG.Performance_Options First_Word_Fall_Through \
  CONFIG.Use_Embedded_Registers true \
] [get_bd_cells CommandProcReadResponses]
create_bd_cell -type ip -vlnv xilinx.com:ip:fifo_generator:13.2 ZStencilReadRequestsFIFO
set_property -dict [list \
  CONFIG.Fifo_Implementation Common_Clock_Builtin_FIFO \
  CONFIG.Input_Data_Width 30 \
  CONFIG.Input_Depth 512 \
  CONFIG.Performance_Options First_Word_Fall_Through \
  CONFIG.Use_Embedded_Registers true \
] [get_bd_cells ZStencilReadRequestsFIFO]
create_bd_cell -type ip -vlnv xilinx.com:ip:fifo_generator:13.2 CommandProcReadRequestsFIFO
set_property -dict [list \
  CONFIG.Fifo_Implementation Common_Clock_Builtin_FIFO \
  CONFIG.Input_Data_Width 30 \
  CONFIG.Input_Depth 512 \
  CONFIG.Performance_Options First_Word_Fall_Through \
  CONFIG.Use_Embedded_Registers true \
] [get_bd_cells CommandProcReadRequestsFIFO]
create_bd_cell -type ip -vlnv xilinx.com:ip:fifo_generator:13.2 PacketDMAReadResponses
set_property -dict [list \
  CONFIG.Fifo_Implementation Common_Clock_Builtin_FIFO \
  CONFIG.Input_Data_Width 256 \
  CONFIG.Input_Depth 512 \
  CONFIG.Performance_Options First_Word_Fall_Through \
  CONFIG.Use_Embedded_Registers true \
] [get_bd_cells PacketDMAReadResponses]
create_bd_cell -type module -reference MemoryController MemoryController_0
create_bd_cell -type ip -vlnv xilinx.com:ip:fifo_generator:13.2 ZStencilWriteRequestsFIFO
set_property -dict [list \
  CONFIG.Fifo_Implementation Common_Clock_Builtin_FIFO \
  CONFIG.Input_Data_Width 294 \
  CONFIG.Input_Depth 512 \
  CONFIG.Performance_Options First_Word_Fall_Through \
  CONFIG.Use_Embedded_Registers true \
] [get_bd_cells ZStencilWriteRequestsFIFO]
create_bd_cell -type ip -vlnv xilinx.com:ip:fifo_generator:13.2 ROPWriteRequestsFIFO
set_property -dict [list \
  CONFIG.Fifo_Implementation Common_Clock_Builtin_FIFO \
  CONFIG.Input_Data_Width 294 \
  CONFIG.Input_Depth 512 \
  CONFIG.Performance_Options First_Word_Fall_Through \
  CONFIG.Use_Embedded_Registers true \
] [get_bd_cells ROPWriteRequestsFIFO]
create_bd_cell -type ip -vlnv xilinx.com:ip:fifo_generator:13.2 TexFetchReadRequestsFIFO
set_property -dict [list \
  CONFIG.Fifo_Implementation Common_Clock_Builtin_FIFO \
  CONFIG.Input_Data_Width 30 \
  CONFIG.Input_Depth 512 \
  CONFIG.Performance_Options First_Word_Fall_Through \
  CONFIG.Use_Embedded_Registers true \
] [get_bd_cells TexFetchReadRequestsFIFO]
create_bd_cell -type ip -vlnv xilinx.com:ip:fifo_generator:13.2 PacketDMAWriteRequestsFIFO
set_property -dict [list \
  CONFIG.Fifo_Implementation Common_Clock_Builtin_FIFO \
  CONFIG.Input_Data_Width 294 \
  CONFIG.Input_Depth 512 \
  CONFIG.Performance_Options First_Word_Fall_Through \
  CONFIG.Use_Embedded_Registers true \
] [get_bd_cells PacketDMAWriteRequestsFIFO]
create_bd_cell -type ip -vlnv xilinx.com:ip:fifo_generator:13.2 ScanoutReadRequestsFIFO
set_property -dict [list \
  CONFIG.Fifo_Implementation Independent_Clocks_Builtin_FIFO \
  CONFIG.Input_Data_Width 30 \
  CONFIG.Input_Depth 512 \
  CONFIG.Performance_Options First_Word_Fall_Through \
  CONFIG.Read_Clock_Frequency 333 \
  CONFIG.Use_Embedded_Registers true \
  CONFIG.Write_Clock_Frequency 250 \
] [get_bd_cells ScanoutReadRequestsFIFO]
create_bd_cell -type ip -vlnv xilinx.com:ip:fifo_generator:13.2 ROPReadResponses
set_property -dict [list \
  CONFIG.Fifo_Implementation Common_Clock_Builtin_FIFO \
  CONFIG.Input_Data_Width 256 \
  CONFIG.Input_Depth 512 \
  CONFIG.Performance_Options First_Word_Fall_Through \
  CONFIG.Use_Embedded_Registers true \
] [get_bd_cells ROPReadResponses]
create_bd_cell -type ip -vlnv xilinx.com:ip:fifo_generator:13.2 VBCacheReadResponses
set_property -dict [list \
  CONFIG.Fifo_Implementation Common_Clock_Builtin_FIFO \
  CONFIG.Input_Data_Width 256 \
  CONFIG.Input_Depth 512 \
  CONFIG.Performance_Options First_Word_Fall_Through \
  CONFIG.Use_Embedded_Registers true \
] [get_bd_cells VBCacheReadResponses]
create_bd_cell -type ip -vlnv xilinx.com:ip:ddr4:2.2 ddr4_0
set_property -dict [list \
  CONFIG.ADDN_UI_CLKOUT1_FREQ_HZ 250 \
  CONFIG.C0_CLOCK_BOARD_INTERFACE default_sysclk1_300 \
  CONFIG.C0_DDR4_BOARD_INTERFACE ddr4_sdram_075 \
  CONFIG.RESET_BOARD_INTERFACE reset \
] [get_bd_cells ddr4_0]
create_bd_cell -type ip -vlnv xilinx.com:ip:fifo_generator:13.2 TexFetchReadResponses
set_property -dict [list \
  CONFIG.Fifo_Implementation Common_Clock_Builtin_FIFO \
  CONFIG.Input_Data_Width 256 \
  CONFIG.Input_Depth 512 \
  CONFIG.Performance_Options First_Word_Fall_Through \
  CONFIG.Use_Embedded_Registers true \
] [get_bd_cells TexFetchReadResponses]
create_bd_cell -type ip -vlnv xilinx.com:ip:fifo_generator:13.2 CommandProcWriteRequestsFIFO
set_property -dict [list \
  CONFIG.Fifo_Implementation Common_Clock_Builtin_FIFO \
  CONFIG.Input_Data_Width 294 \
  CONFIG.Input_Depth 512 \
  CONFIG.Performance_Options First_Word_Fall_Through \
  CONFIG.Use_Embedded_Registers true \
] [get_bd_cells CommandProcWriteRequestsFIFO]
create_bd_cell -type ip -vlnv xilinx.com:ip:fifo_generator:13.2 ClearBlockWriteRequestsFIFO
set_property -dict [list \
  CONFIG.Fifo_Implementation Common_Clock_Builtin_FIFO \
  CONFIG.Input_Data_Width 294 \
  CONFIG.Input_Depth 512 \
  CONFIG.Performance_Options First_Word_Fall_Through \
  CONFIG.Use_Embedded_Registers true \
] [get_bd_cells ClearBlockWriteRequestsFIFO]
create_bd_cell -type ip -vlnv xilinx.com:ip:fifo_generator:13.2 ROPReadRequestsFIFO
set_property -dict [list \
  CONFIG.Fifo_Implementation Common_Clock_Builtin_FIFO \
  CONFIG.Input_Data_Width 30 \
  CONFIG.Input_Depth 512 \
  CONFIG.Performance_Options First_Word_Fall_Through \
  CONFIG.Use_Embedded_Registers true \
] [get_bd_cells ROPReadRequestsFIFO]
create_bd_cell -type ip -vlnv xilinx.com:ip:fifo_generator:13.2 IBCacheReadRequestsFIFO
set_property -dict [list \
  CONFIG.Fifo_Implementation Common_Clock_Builtin_FIFO \
  CONFIG.Input_Data_Width 30 \
  CONFIG.Input_Depth 512 \
  CONFIG.Performance_Options First_Word_Fall_Through \
  CONFIG.Use_Embedded_Registers true \
] [get_bd_cells IBCacheReadRequestsFIFO]
create_bd_cell -type ip -vlnv xilinx.com:ip:fifo_generator:13.2 VBCacheReadRequestsFIFO
set_property -dict [list \
  CONFIG.Fifo_Implementation Common_Clock_Builtin_FIFO \
  CONFIG.Input_Data_Width 30 \
  CONFIG.Input_Depth 512 \
  CONFIG.Performance_Options First_Word_Fall_Through \
  CONFIG.Use_Embedded_Registers true \
] [get_bd_cells VBCacheReadRequestsFIFO]
create_bd_cell -type ip -vlnv xilinx.com:ip:proc_sys_reset:5.0 mem_sys_reset
create_bd_cell -type module -reference ResetN_UntilClockLocked ResetN_UntilClockLocked
create_bd_cell -type inline_hdl -vlnv xilinx.com:inline_hdl:ilconstant:1.0 constant_always_locked
create_bd_cell -type ip -vlnv xilinx.com:ip:fifo_generator:13.2 StatsWriteRequestsFIFO
set_property -dict [list \
  CONFIG.Fifo_Implementation Common_Clock_Builtin_FIFO \
  CONFIG.Input_Data_Width 294 \
  CONFIG.Input_Depth 512 \
  CONFIG.Performance_Options First_Word_Fall_Through \
  CONFIG.Use_Embedded_Registers true \
] [get_bd_cells StatsWriteRequestsFIFO]

# ---- hierarchy /ShaderCoreSystem ----
current_bd_instance /ShaderCoreSystem
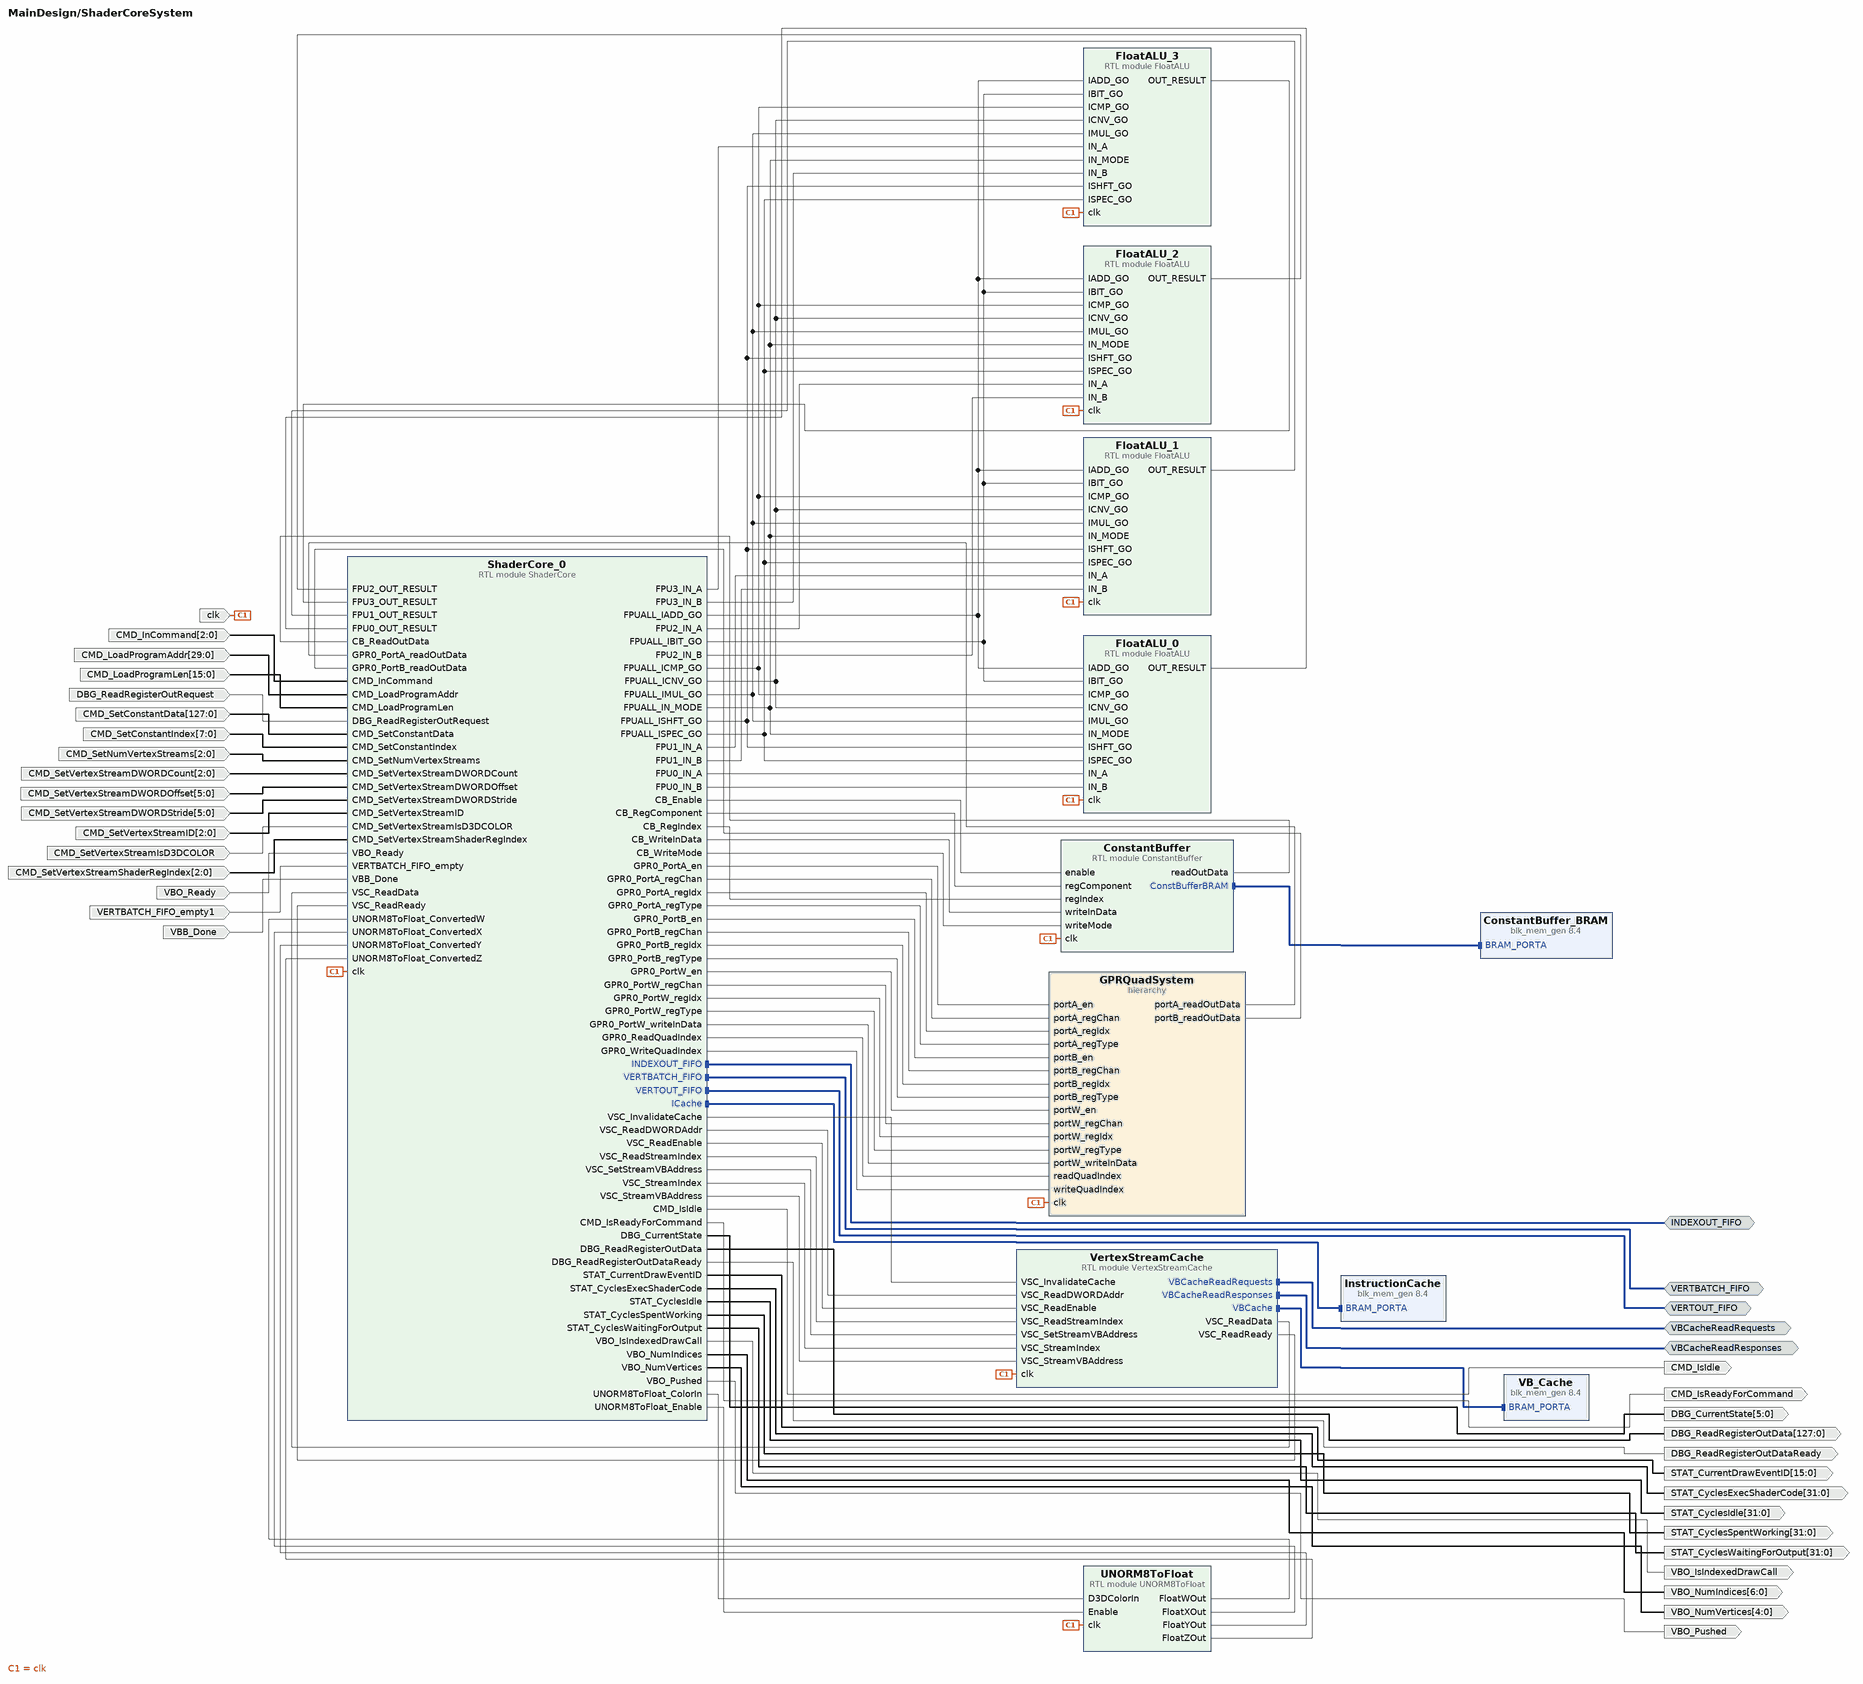
[diagram p8: block diagram inside /ShaderCoreSystem]
create_bd_intf_pin -mode Master -vlnv xilinx.com:interface:fifo_read_rtl:1.0 VERTBATCH_FIFO
create_bd_intf_pin -mode Master -vlnv xilinx.com:interface:fifo_write_rtl:1.0 VBCacheReadRequests
create_bd_intf_pin -mode Master -vlnv xilinx.com:interface:fifo_read_rtl:1.0 VBCacheReadResponses
create_bd_intf_pin -mode Master -vlnv xilinx.com:interface:fifo_write_rtl:1.0 VERTOUT_FIFO
create_bd_intf_pin -mode Master -vlnv xilinx.com:interface:fifo_write_rtl:1.0 INDEXOUT_FIFO
create_bd_pin -dir I -type clk clk
create_bd_pin -dir O CMD_IsIdle
create_bd_pin -dir O CMD_IsReadyForCommand
create_bd_pin -dir I -from 2 -to 0 CMD_InCommand
create_bd_pin -dir I -from 29 -to 0 CMD_LoadProgramAddr
create_bd_pin -dir I -from 15 -to 0 CMD_LoadProgramLen
create_bd_pin -dir I -from 7 -to 0 CMD_SetConstantIndex
create_bd_pin -dir I -from 127 -to 0 CMD_SetConstantData
create_bd_pin -dir I -from 2 -to 0 CMD_SetNumVertexStreams
create_bd_pin -dir I -from 2 -to 0 CMD_SetVertexStreamID
create_bd_pin -dir I -from 2 -to 0 CMD_SetVertexStreamDWORDCount
create_bd_pin -dir I CMD_SetVertexStreamIsD3DCOLOR
create_bd_pin -dir I -from 2 -to 0 CMD_SetVertexStreamShaderRegIndex
create_bd_pin -dir I -from 5 -to 0 CMD_SetVertexStreamDWORDStride
create_bd_pin -dir I -from 5 -to 0 CMD_SetVertexStreamDWORDOffset
create_bd_pin -dir I VBB_Done
create_bd_pin -dir I DBG_ReadRegisterOutRequest
create_bd_pin -dir O DBG_ReadRegisterOutDataReady
create_bd_pin -dir O -from 127 -to 0 DBG_ReadRegisterOutData
create_bd_pin -dir O VBO_Pushed
create_bd_pin -dir O -from 4 -to 0 VBO_NumVertices
create_bd_pin -dir O -from 6 -to 0 VBO_NumIndices
create_bd_pin -dir O VBO_IsIndexedDrawCall
create_bd_pin -dir I VBO_Ready
create_bd_pin -dir O -from 31 -to 0 STAT_CyclesIdle
create_bd_pin -dir O -from 31 -to 0 STAT_CyclesSpentWorking
create_bd_pin -dir O -from 31 -to 0 STAT_CyclesExecShaderCode
create_bd_pin -dir O -from 31 -to 0 STAT_CyclesWaitingForOutput
create_bd_pin -dir O -from 15 -to 0 STAT_CurrentDrawEventID
create_bd_pin -dir I VERTBATCH_FIFO_empty1
create_bd_pin -dir O -from 5 -to 0 DBG_CurrentState

create_bd_cell -type module -reference FloatALU FloatALU_0
create_bd_cell -type module -reference FloatALU FloatALU_1
create_bd_cell -type ip -vlnv xilinx.com:ip:blk_mem_gen:8.4 ConstantBuffer_BRAM
set_property -dict [list \
  CONFIG.Operating_Mode_A NO_CHANGE \
  CONFIG.Register_PortA_Output_of_Memory_Core true \
  CONFIG.Write_Depth_A 1024 \
  CONFIG.use_bram_block Stand_Alone \
] [get_bd_cells ConstantBuffer_BRAM]
create_bd_cell -type module -reference FloatALU FloatALU_2
create_bd_cell -type module -reference FloatALU FloatALU_3
create_bd_cell -type module -reference UNORM8ToFloat UNORM8ToFloat
create_bd_cell -type ip -vlnv xilinx.com:ip:blk_mem_gen:8.4 InstructionCache
set_property -dict [list \
  CONFIG.Operating_Mode_A NO_CHANGE \
  CONFIG.Register_PortA_Output_of_Memory_Core true \
  CONFIG.Register_PortA_Output_of_Memory_Primitives true \
  CONFIG.Write_Depth_A 512 \
  CONFIG.Write_Width_A 64 \
  CONFIG.use_bram_block Stand_Alone \
] [get_bd_cells InstructionCache]
create_bd_cell -type ip -vlnv xilinx.com:ip:blk_mem_gen:8.4 VB_Cache
set_property -dict [list \
  CONFIG.Operating_Mode_A NO_CHANGE \
  CONFIG.Register_PortA_Output_of_Memory_Primitives false \
  CONFIG.Write_Depth_A 1024 \
  CONFIG.use_bram_block Stand_Alone \
] [get_bd_cells VB_Cache]
create_bd_cell -type module -reference ShaderCore ShaderCore_0
create_bd_cell -type module -reference VertexStreamCache VertexStreamCache
create_bd_cell -type module -reference ConstantBuffer ConstantBuffer
create_bd_cell -type hier GPRQuadSystem

# ---- hierarchy /ShaderCoreSystem/GPRQuadSystem ----
current_bd_instance /ShaderCoreSystem/GPRQuadSystem
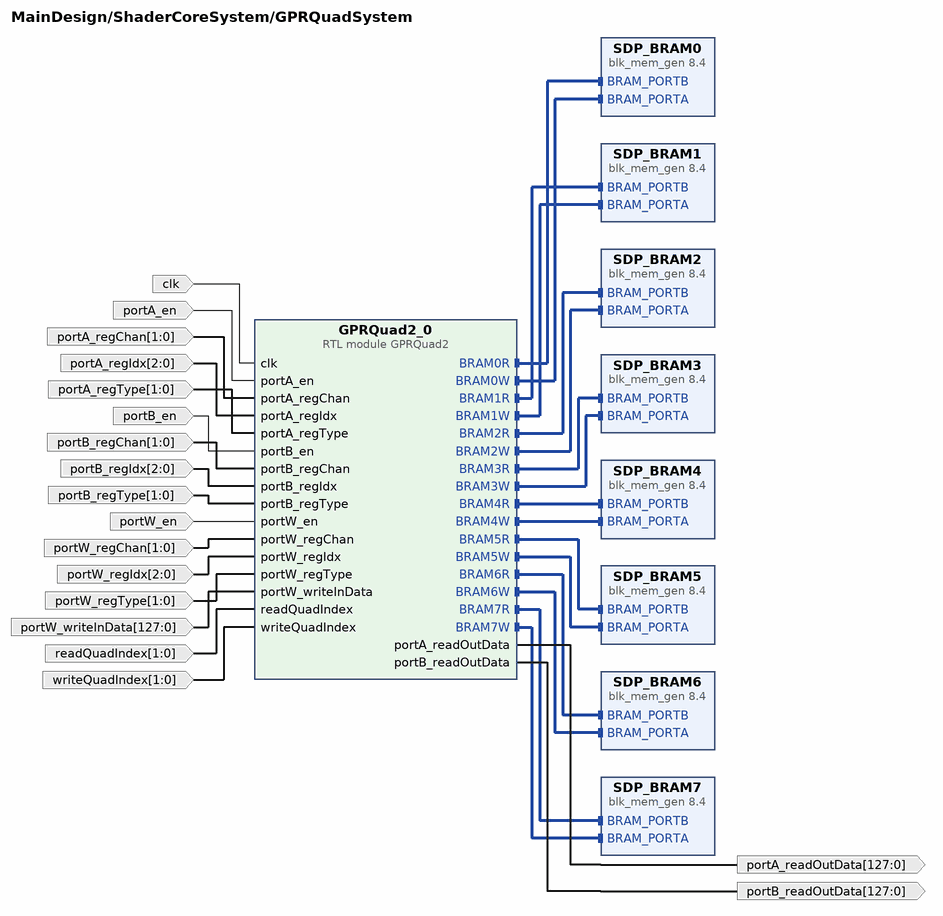
[diagram p9: block diagram inside /ShaderCoreSystem/GPRQuadSystem]
create_bd_pin -dir I -type clk clk
create_bd_pin -dir I -from 1 -to 0 readQuadIndex
create_bd_pin -dir I -from 1 -to 0 writeQuadIndex
create_bd_pin -dir I portA_en
create_bd_pin -dir I -from 1 -to 0 portA_regType
create_bd_pin -dir I -from 2 -to 0 portA_regIdx
create_bd_pin -dir I -from 1 -to 0 portA_regChan
create_bd_pin -dir I portB_en
create_bd_pin -dir I -from 1 -to 0 portB_regType
create_bd_pin -dir I -from 2 -to 0 portB_regIdx
create_bd_pin -dir I -from 1 -to 0 portB_regChan
create_bd_pin -dir I portW_en
create_bd_pin -dir I -from 1 -to 0 portW_regType
create_bd_pin -dir I -from 2 -to 0 portW_regIdx
create_bd_pin -dir I -from 1 -to 0 portW_regChan
create_bd_pin -dir I -from 127 -to 0 portW_writeInData
create_bd_pin -dir O -from 127 -to 0 portA_readOutData
create_bd_pin -dir O -from 127 -to 0 portB_readOutData

create_bd_cell -type ip -vlnv xilinx.com:ip:blk_mem_gen:8.4 SDP_BRAM5
set_property -dict [list \
  CONFIG.Assume_Synchronous_Clk true \
  CONFIG.Memory_Type Simple_Dual_Port_RAM \
  CONFIG.Register_PortB_Output_of_Memory_Core true \
  CONFIG.Register_PortB_Output_of_Memory_Primitives true \
  CONFIG.Write_Depth_A 512 \
  CONFIG.use_bram_block Stand_Alone \
] [get_bd_cells SDP_BRAM5]
create_bd_cell -type ip -vlnv xilinx.com:ip:blk_mem_gen:8.4 SDP_BRAM6
set_property -dict [list \
  CONFIG.Assume_Synchronous_Clk true \
  CONFIG.Memory_Type Simple_Dual_Port_RAM \
  CONFIG.Register_PortB_Output_of_Memory_Core true \
  CONFIG.Register_PortB_Output_of_Memory_Primitives true \
  CONFIG.Write_Depth_A 512 \
  CONFIG.use_bram_block Stand_Alone \
] [get_bd_cells SDP_BRAM6]
create_bd_cell -type ip -vlnv xilinx.com:ip:blk_mem_gen:8.4 SDP_BRAM7
set_property -dict [list \
  CONFIG.Assume_Synchronous_Clk true \
  CONFIG.Memory_Type Simple_Dual_Port_RAM \
  CONFIG.Register_PortB_Output_of_Memory_Core true \
  CONFIG.Register_PortB_Output_of_Memory_Primitives true \
  CONFIG.Write_Depth_A 512 \
  CONFIG.use_bram_block Stand_Alone \
] [get_bd_cells SDP_BRAM7]
create_bd_cell -type ip -vlnv xilinx.com:ip:blk_mem_gen:8.4 SDP_BRAM0
set_property -dict [list \
  CONFIG.Assume_Synchronous_Clk true \
  CONFIG.Memory_Type Simple_Dual_Port_RAM \
  CONFIG.Register_PortB_Output_of_Memory_Core true \
  CONFIG.Register_PortB_Output_of_Memory_Primitives true \
  CONFIG.Write_Depth_A 512 \
  CONFIG.use_bram_block Stand_Alone \
] [get_bd_cells SDP_BRAM0]
create_bd_cell -type ip -vlnv xilinx.com:ip:blk_mem_gen:8.4 SDP_BRAM1
set_property -dict [list \
  CONFIG.Assume_Synchronous_Clk true \
  CONFIG.Memory_Type Simple_Dual_Port_RAM \
  CONFIG.Register_PortB_Output_of_Memory_Core true \
  CONFIG.Register_PortB_Output_of_Memory_Primitives true \
  CONFIG.Write_Depth_A 512 \
  CONFIG.use_bram_block Stand_Alone \
] [get_bd_cells SDP_BRAM1]
create_bd_cell -type ip -vlnv xilinx.com:ip:blk_mem_gen:8.4 SDP_BRAM2
set_property -dict [list \
  CONFIG.Assume_Synchronous_Clk true \
  CONFIG.Memory_Type Simple_Dual_Port_RAM \
  CONFIG.Register_PortB_Output_of_Memory_Core true \
  CONFIG.Register_PortB_Output_of_Memory_Primitives true \
  CONFIG.Write_Depth_A 512 \
  CONFIG.use_bram_block Stand_Alone \
] [get_bd_cells SDP_BRAM2]
create_bd_cell -type ip -vlnv xilinx.com:ip:blk_mem_gen:8.4 SDP_BRAM3
set_property -dict [list \
  CONFIG.Assume_Synchronous_Clk true \
  CONFIG.Memory_Type Simple_Dual_Port_RAM \
  CONFIG.Register_PortB_Output_of_Memory_Core true \
  CONFIG.Register_PortB_Output_of_Memory_Primitives true \
  CONFIG.Write_Depth_A 512 \
  CONFIG.use_bram_block Stand_Alone \
] [get_bd_cells SDP_BRAM3]
create_bd_cell -type ip -vlnv xilinx.com:ip:blk_mem_gen:8.4 SDP_BRAM4
set_property -dict [list \
  CONFIG.Assume_Synchronous_Clk true \
  CONFIG.Memory_Type Simple_Dual_Port_RAM \
  CONFIG.Register_PortB_Output_of_Memory_Core true \
  CONFIG.Register_PortB_Output_of_Memory_Primitives true \
  CONFIG.Write_Depth_A 512 \
  CONFIG.use_bram_block Stand_Alone \
] [get_bd_cells SDP_BRAM4]
create_bd_cell -type module -reference GPRQuad2 GPRQuad2_0

# ---- hierarchy /ScanoutSystem ----
current_bd_instance /ScanoutSystem
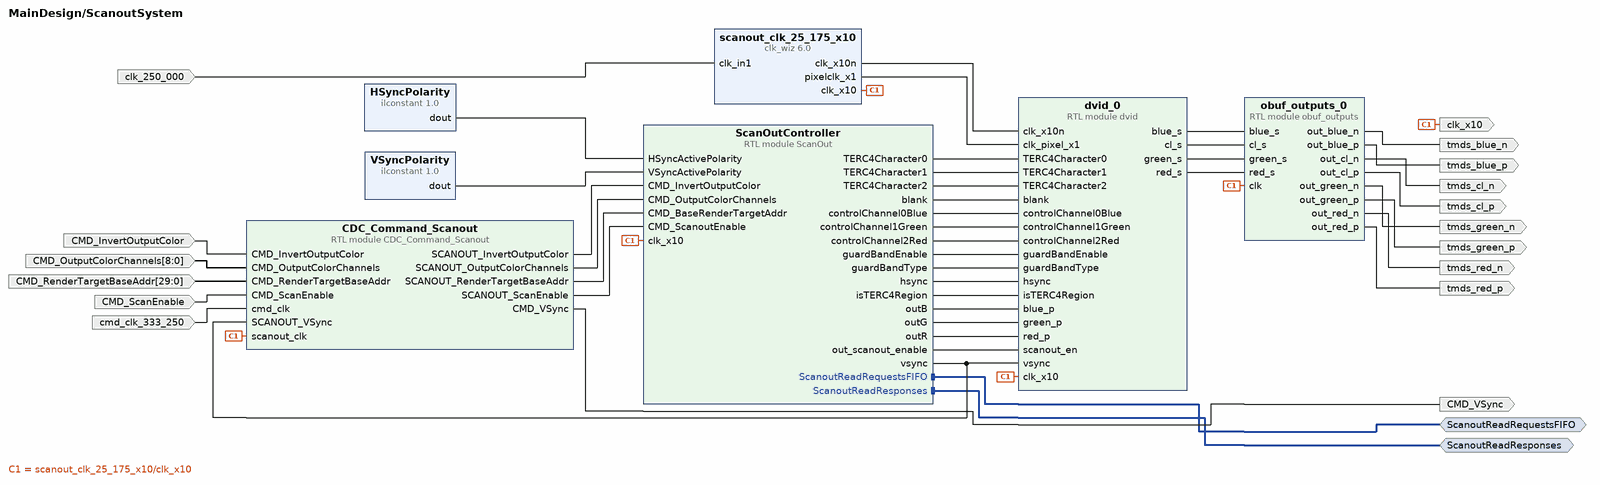
[diagram p10: block diagram inside /ScanoutSystem]
create_bd_intf_pin -mode Master -vlnv xilinx.com:interface:fifo_write_rtl:1.0 ScanoutReadRequestsFIFO
create_bd_intf_pin -mode Master -vlnv xilinx.com:interface:fifo_read_rtl:1.0 ScanoutReadResponses
create_bd_pin -dir I -type clk cmd_clk_333_250
create_bd_pin -dir O CMD_VSync
create_bd_pin -dir I -from 29 -to 0 CMD_RenderTargetBaseAddr
create_bd_pin -dir I CMD_ScanEnable
create_bd_pin -dir I CMD_InvertOutputColor
create_bd_pin -dir I -from 8 -to 0 CMD_OutputColorChannels
create_bd_pin -dir O -type clk clk_x10
create_bd_pin -dir O tmds_red_p
create_bd_pin -dir O tmds_red_n
create_bd_pin -dir O tmds_green_p
create_bd_pin -dir O tmds_green_n
create_bd_pin -dir O tmds_blue_p
create_bd_pin -dir O tmds_blue_n
create_bd_pin -dir O tmds_cl_p
create_bd_pin -dir O tmds_cl_n
create_bd_pin -dir I -type clk clk_250_000

create_bd_cell -type module -reference CDC_Command_Scanout CDC_Command_Scanout
create_bd_cell -type inline_hdl -vlnv xilinx.com:inline_hdl:ilconstant:1.0 HSyncPolarity
set_property -dict {CONFIG.CONST_VAL 0} [get_bd_cells HSyncPolarity]
create_bd_cell -type module -reference dvid dvid_0
create_bd_cell -type inline_hdl -vlnv xilinx.com:inline_hdl:ilconstant:1.0 VSyncPolarity
set_property -dict {CONFIG.CONST_VAL 0} [get_bd_cells VSyncPolarity]
create_bd_cell -type module -reference ScanOut ScanOutController
set_property -dict {CONFIG.Use_HDMI true} [get_bd_cells ScanOutController]
create_bd_cell -type module -reference obuf_outputs obuf_outputs_0
create_bd_cell -type ip -vlnv xilinx.com:ip:clk_wiz:6.0 scanout_clk_25_175_x10
set_property -dict [list \
  CONFIG.AUTO_PRIMITIVE MMCM \
  CONFIG.CLKIN1_JITTER_PS 40.0 \
  CONFIG.CLKOUT1_DRIVES Buffer \
  CONFIG.CLKOUT1_JITTER 169.784 \
  CONFIG.CLKOUT1_PHASE_ERROR 328.812 \
  CONFIG.CLKOUT1_REQUESTED_OUT_FREQ 251.750 \
  CONFIG.CLKOUT2_DRIVES Buffer \
  CONFIG.CLKOUT2_JITTER 236.903 \
  CONFIG.CLKOUT2_PHASE_ERROR 328.812 \
  CONFIG.CLKOUT2_REQUESTED_OUT_FREQ 25.175 \
  CONFIG.CLKOUT2_USED true \
  CONFIG.CLKOUT3_DRIVES Buffer \
  CONFIG.CLKOUT3_JITTER 169.784 \
  CONFIG.CLKOUT3_PHASE_ERROR 328.812 \
  CONFIG.CLKOUT3_REQUESTED_OUT_FREQ 251.750 \
  CONFIG.CLKOUT3_REQUESTED_PHASE 180 \
  CONFIG.CLKOUT3_USED true \
  CONFIG.CLKOUT4_DRIVES Buffer \
  CONFIG.CLKOUT5_DRIVES Buffer \
  CONFIG.CLKOUT6_DRIVES Buffer \
  CONFIG.CLKOUT7_DRIVES Buffer \
  CONFIG.CLK_OUT1_PORT clk_x10 \
  CONFIG.CLK_OUT2_PORT pixelclk_x1 \
  CONFIG.CLK_OUT3_PORT clk_x10n \
  CONFIG.FEEDBACK_SOURCE FDBK_AUTO \
  CONFIG.MMCM_BANDWIDTH OPTIMIZED \
  CONFIG.MMCM_CLKFBOUT_MULT_F 125.875 \
  CONFIG.MMCM_CLKIN1_PERIOD 4.000 \
  CONFIG.MMCM_CLKIN2_PERIOD 10.0 \
  CONFIG.MMCM_CLKOUT0_DIVIDE_F 5.000 \
  CONFIG.MMCM_CLKOUT1_DIVIDE 50 \
  CONFIG.MMCM_CLKOUT2_DIVIDE 5 \
  CONFIG.MMCM_CLKOUT2_PHASE 180.000 \
  CONFIG.MMCM_COMPENSATION AUTO \
  CONFIG.MMCM_DIVCLK_DIVIDE 25 \
  CONFIG.NUM_OUT_CLKS 3 \
  CONFIG.OPTIMIZE_CLOCKING_STRUCTURE_EN true \
  CONFIG.PRIMITIVE MMCM \
  CONFIG.PRIM_IN_FREQ 250 \
  CONFIG.USE_LOCKED false \
  CONFIG.USE_RESET false \
] [get_bd_cells scanout_clk_25_175_x10]

# ---- hierarchy /StatsSystem ----
current_bd_instance /StatsSystem
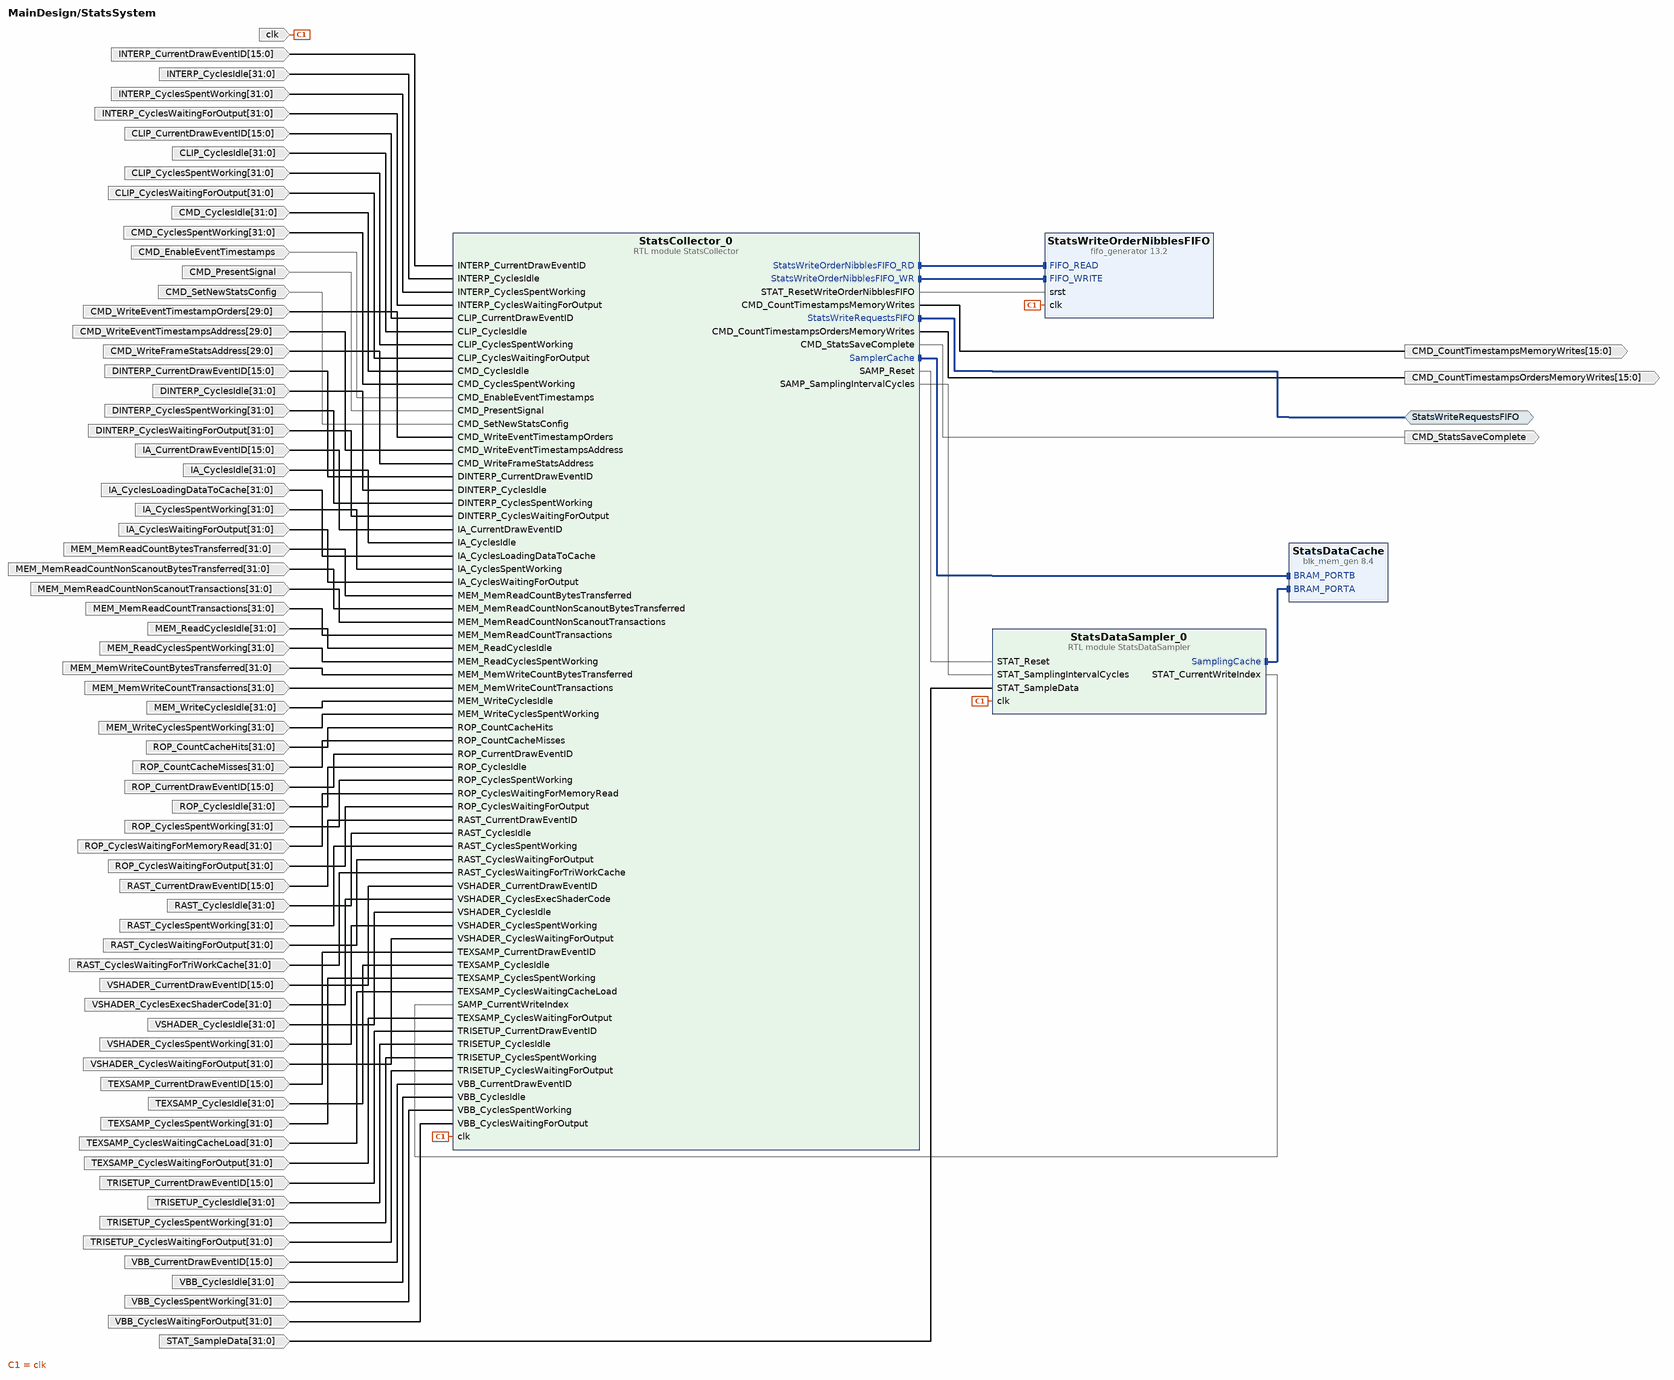
[diagram p11: block diagram inside /StatsSystem]
create_bd_intf_pin -mode Master -vlnv xilinx.com:interface:fifo_write_rtl:1.0 StatsWriteRequestsFIFO
create_bd_pin -dir I -type clk clk
create_bd_pin -dir I -from 31 -to 0 STAT_SampleData
create_bd_pin -dir I CMD_PresentSignal
create_bd_pin -dir I CMD_SetNewStatsConfig
create_bd_pin -dir I -from 29 -to 0 CMD_WriteFrameStatsAddress
create_bd_pin -dir I CMD_EnableEventTimestamps
create_bd_pin -dir I -from 29 -to 0 CMD_WriteEventTimestampsAddress
create_bd_pin -dir I -from 29 -to 0 CMD_WriteEventTimestampOrders
create_bd_pin -dir O -from 15 -to 0 CMD_CountTimestampsMemoryWrites
create_bd_pin -dir O -from 15 -to 0 CMD_CountTimestampsOrdersMemoryWrites
create_bd_pin -dir O CMD_StatsSaveComplete
create_bd_pin -dir I -from 31 -to 0 VBB_CyclesIdle
create_bd_pin -dir I -from 31 -to 0 VBB_CyclesSpentWorking
create_bd_pin -dir I -from 31 -to 0 VBB_CyclesWaitingForOutput
create_bd_pin -dir I -from 15 -to 0 VBB_CurrentDrawEventID
create_bd_pin -dir I -from 31 -to 0 VSHADER_CyclesIdle
create_bd_pin -dir I -from 31 -to 0 VSHADER_CyclesSpentWorking
create_bd_pin -dir I -from 31 -to 0 VSHADER_CyclesExecShaderCode
create_bd_pin -dir I -from 31 -to 0 VSHADER_CyclesWaitingForOutput
create_bd_pin -dir I -from 15 -to 0 VSHADER_CurrentDrawEventID
create_bd_pin -dir I -from 31 -to 0 IA_CyclesIdle
create_bd_pin -dir I -from 31 -to 0 IA_CyclesSpentWorking
create_bd_pin -dir I -from 31 -to 0 IA_CyclesLoadingDataToCache
create_bd_pin -dir I -from 31 -to 0 IA_CyclesWaitingForOutput
create_bd_pin -dir I -from 15 -to 0 IA_CurrentDrawEventID
create_bd_pin -dir I -from 31 -to 0 CLIP_CyclesIdle
create_bd_pin -dir I -from 31 -to 0 CLIP_CyclesSpentWorking
create_bd_pin -dir I -from 31 -to 0 CLIP_CyclesWaitingForOutput
create_bd_pin -dir I -from 15 -to 0 CLIP_CurrentDrawEventID
create_bd_pin -dir I -from 31 -to 0 TRISETUP_CyclesIdle
create_bd_pin -dir I -from 31 -to 0 TRISETUP_CyclesSpentWorking
create_bd_pin -dir I -from 31 -to 0 TRISETUP_CyclesWaitingForOutput
create_bd_pin -dir I -from 15 -to 0 TRISETUP_CurrentDrawEventID
create_bd_pin -dir I -from 31 -to 0 RAST_CyclesIdle
create_bd_pin -dir I -from 31 -to 0 RAST_CyclesSpentWorking
create_bd_pin -dir I -from 31 -to 0 RAST_CyclesWaitingForOutput
create_bd_pin -dir I -from 31 -to 0 RAST_CyclesWaitingForTriWorkCache
create_bd_pin -dir I -from 15 -to 0 RAST_CurrentDrawEventID
create_bd_pin -dir I -from 31 -to 0 DINTERP_CyclesIdle
create_bd_pin -dir I -from 31 -to 0 DINTERP_CyclesSpentWorking
create_bd_pin -dir I -from 31 -to 0 DINTERP_CyclesWaitingForOutput
create_bd_pin -dir I -from 15 -to 0 DINTERP_CurrentDrawEventID
create_bd_pin -dir I -from 31 -to 0 INTERP_CyclesIdle
create_bd_pin -dir I -from 31 -to 0 INTERP_CyclesSpentWorking
create_bd_pin -dir I -from 31 -to 0 INTERP_CyclesWaitingForOutput
create_bd_pin -dir I -from 15 -to 0 INTERP_CurrentDrawEventID
create_bd_pin -dir I -from 31 -to 0 TEXSAMP_CyclesIdle
create_bd_pin -dir I -from 31 -to 0 TEXSAMP_CyclesSpentWorking
create_bd_pin -dir I -from 31 -to 0 TEXSAMP_CyclesWaitingForOutput
create_bd_pin -dir I -from 31 -to 0 TEXSAMP_CyclesWaitingCacheLoad
create_bd_pin -dir I -from 15 -to 0 TEXSAMP_CurrentDrawEventID
create_bd_pin -dir I -from 31 -to 0 ROP_CyclesIdle
create_bd_pin -dir I -from 31 -to 0 ROP_CyclesSpentWorking
create_bd_pin -dir I -from 31 -to 0 ROP_CyclesWaitingForOutput
create_bd_pin -dir I -from 31 -to 0 ROP_CyclesWaitingForMemoryRead
create_bd_pin -dir I -from 31 -to 0 ROP_CountCacheHits
create_bd_pin -dir I -from 31 -to 0 ROP_CountCacheMisses
create_bd_pin -dir I -from 15 -to 0 ROP_CurrentDrawEventID
create_bd_pin -dir I -from 31 -to 0 CMD_CyclesIdle
create_bd_pin -dir I -from 31 -to 0 CMD_CyclesSpentWorking
create_bd_pin -dir I -from 31 -to 0 MEM_ReadCyclesIdle
create_bd_pin -dir I -from 31 -to 0 MEM_ReadCyclesSpentWorking
create_bd_pin -dir I -from 31 -to 0 MEM_WriteCyclesIdle
create_bd_pin -dir I -from 31 -to 0 MEM_WriteCyclesSpentWorking
create_bd_pin -dir I -from 31 -to 0 MEM_MemReadCountBytesTransferred
create_bd_pin -dir I -from 31 -to 0 MEM_MemReadCountTransactions
create_bd_pin -dir I -from 31 -to 0 MEM_MemReadCountNonScanoutBytesTransferred
create_bd_pin -dir I -from 31 -to 0 MEM_MemReadCountNonScanoutTransactions
create_bd_pin -dir I -from 31 -to 0 MEM_MemWriteCountBytesTransferred
create_bd_pin -dir I -from 31 -to 0 MEM_MemWriteCountTransactions

create_bd_cell -type ip -vlnv xilinx.com:ip:blk_mem_gen:8.4 StatsDataCache
set_property -dict [list \
  CONFIG.Memory_Type Simple_Dual_Port_RAM \
  CONFIG.Write_Depth_A 1024 \
  CONFIG.use_bram_block Stand_Alone \
] [get_bd_cells StatsDataCache]
create_bd_cell -type ip -vlnv xilinx.com:ip:fifo_generator:13.2 StatsWriteOrderNibblesFIFO
set_property -dict [list \
  CONFIG.Input_Data_Width 16 \
  CONFIG.Input_Depth 8192 \
  CONFIG.Performance_Options First_Word_Fall_Through \
] [get_bd_cells StatsWriteOrderNibblesFIFO]
create_bd_cell -type module -reference StatsDataSampler StatsDataSampler_0
create_bd_cell -type module -reference StatsCollector StatsCollector_0

# ---- hierarchy /NetworkPacketSystem ----
current_bd_instance /NetworkPacketSystem
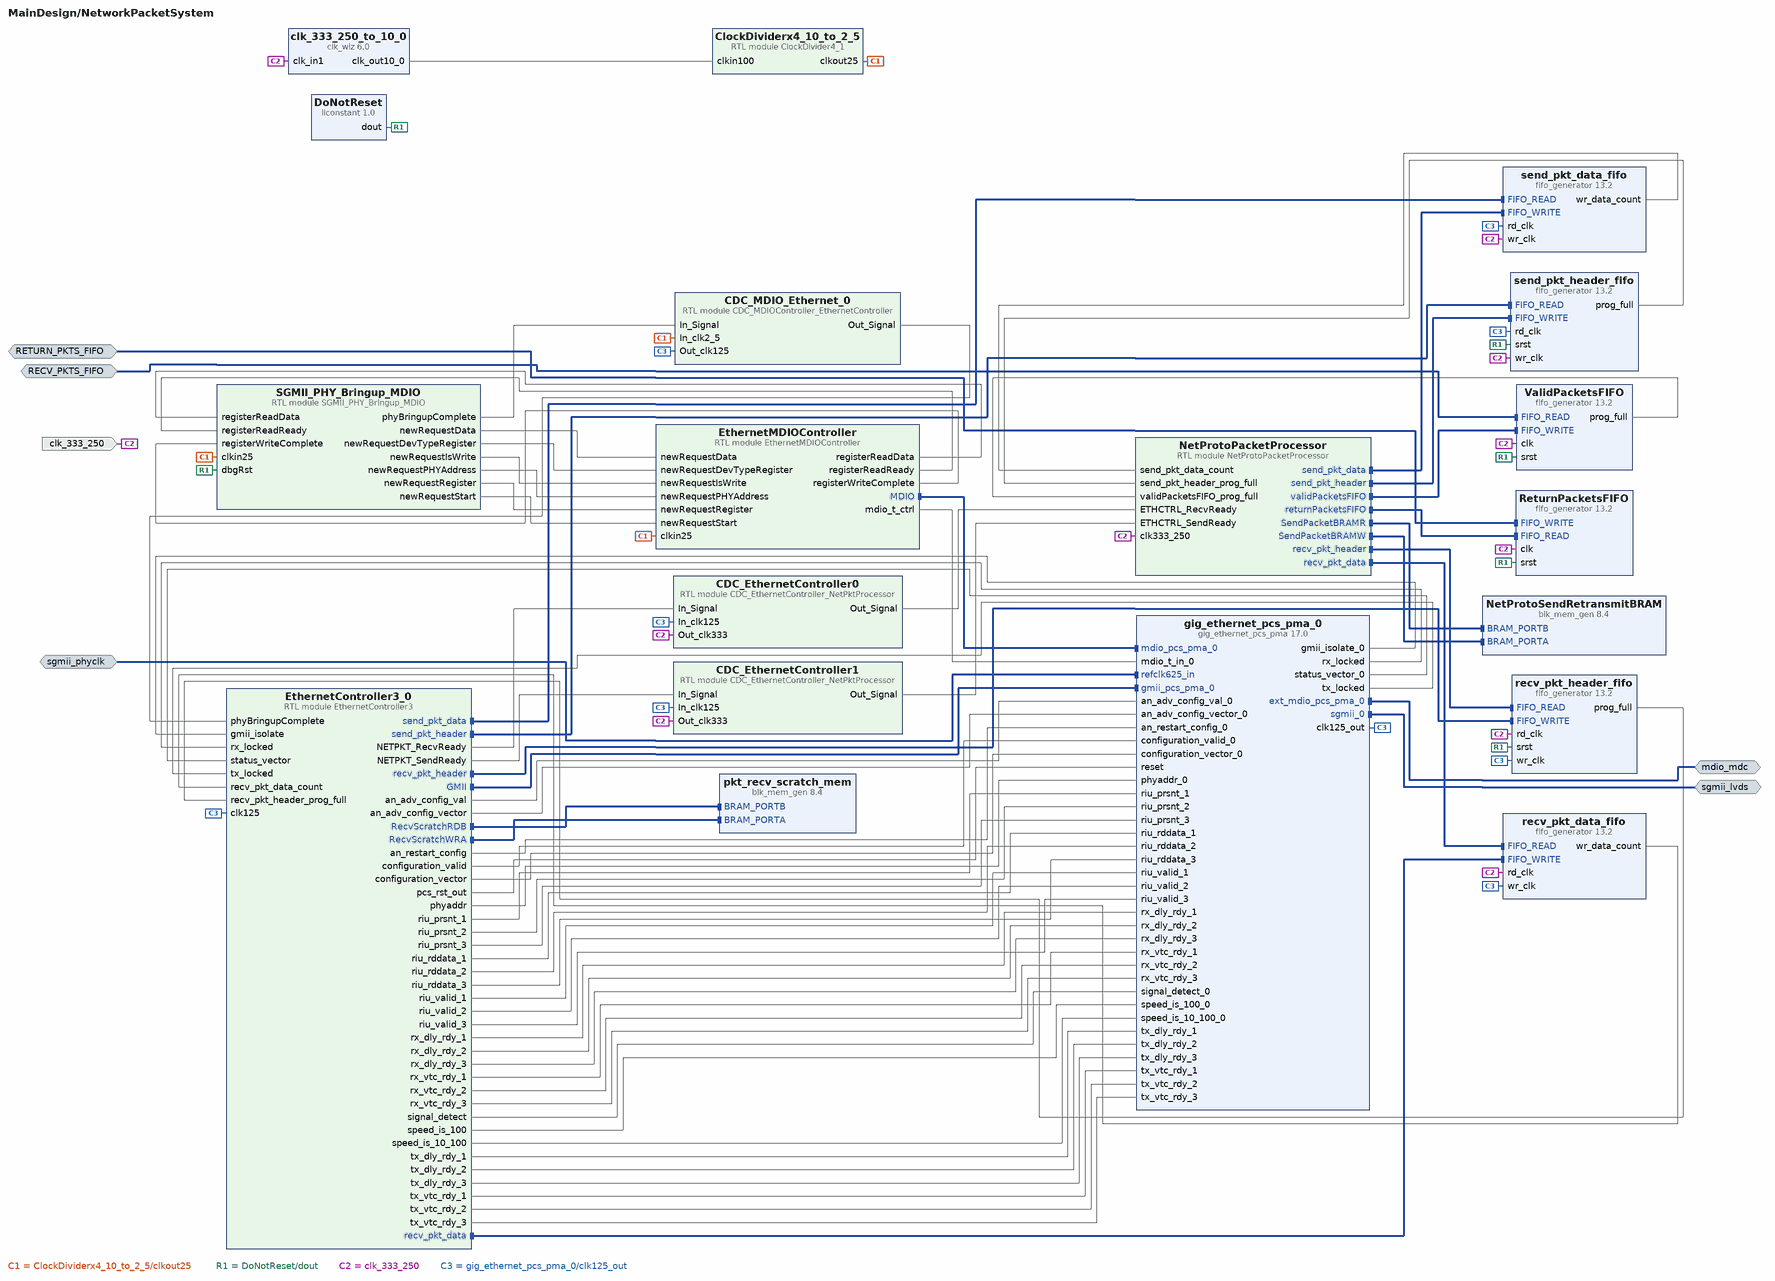
[diagram p12: block diagram inside /NetworkPacketSystem]
create_bd_intf_pin -mode Slave -vlnv xilinx.com:interface:fifo_read_rtl:1.0 RECV_PKTS_FIFO
create_bd_intf_pin -mode Slave -vlnv xilinx.com:interface:fifo_write_rtl:1.0 RETURN_PKTS_FIFO
create_bd_intf_pin -mode Master -vlnv xilinx.com:interface:mdio_rtl:1.0 mdio_mdc
create_bd_intf_pin -mode Master -vlnv xilinx.com:interface:sgmii_rtl:1.0 sgmii_lvds
create_bd_intf_pin -mode Slave -vlnv xilinx.com:interface:diff_clock_rtl:1.0 sgmii_phyclk
create_bd_pin -dir I -type clk clk_333_250

create_bd_cell -type ip -vlnv xilinx.com:ip:clk_wiz:6.0 clk_333_250_to_10_0
set_property -dict [list \
  CONFIG.CLKOUT1_JITTER 347.689 \
  CONFIG.CLKOUT1_PHASE_ERROR 416.311 \
  CONFIG.CLKOUT1_REQUESTED_OUT_FREQ 10 \
  CONFIG.CLK_OUT1_PORT clk_out10_0 \
  CONFIG.MMCM_CLKFBOUT_MULT_F 100.000 \
  CONFIG.MMCM_CLKOUT0_DIVIDE_F 107.500 \
  CONFIG.MMCM_DIVCLK_DIVIDE 31 \
  CONFIG.OPTIMIZE_CLOCKING_STRUCTURE_EN true \
  CONFIG.USE_LOCKED false \
  CONFIG.USE_RESET false \
] [get_bd_cells clk_333_250_to_10_0]
create_bd_cell -type module -reference EthernetMDIOController EthernetMDIOController
create_bd_cell -type ip -vlnv xilinx.com:ip:fifo_generator:13.2 ValidPacketsFIFO
set_property -dict [list \
  CONFIG.Full_Threshold_Assert_Value 345 \
  CONFIG.Input_Data_Width 88 \
  CONFIG.Input_Depth 512 \
  CONFIG.Performance_Options First_Word_Fall_Through \
  CONFIG.Programmable_Full_Type Single_Programmable_Full_Threshold_Constant \
  CONFIG.Use_Embedded_Registers false \
] [get_bd_cells ValidPacketsFIFO]
create_bd_cell -type module -reference SGMII_PHY_Bringup_MDIO SGMII_PHY_Bringup_MDIO
create_bd_cell -type module -reference CDC_EthernetController_NetPktProcessor CDC_EthernetController1
create_bd_cell -type ip -vlnv xilinx.com:ip:blk_mem_gen:8.4 NetProtoSendRetransmitBRAM
set_property -dict [list \
  CONFIG.Memory_Type Simple_Dual_Port_RAM \
  CONFIG.Register_PortB_Output_of_Memory_Primitives false \
  CONFIG.Write_Depth_A 512 \
  CONFIG.use_bram_block Stand_Alone \
] [get_bd_cells NetProtoSendRetransmitBRAM]
create_bd_cell -type module -reference ClockDivider4_1 ClockDividerx4_10_to_2_5
create_bd_cell -type module -reference NetProtoPacketProcessor NetProtoPacketProcessor
create_bd_cell -type ip -vlnv xilinx.com:ip:fifo_generator:13.2 ReturnPacketsFIFO
set_property -dict [list \
  CONFIG.Full_Threshold_Assert_Value 505 \
  CONFIG.Input_Data_Width 88 \
  CONFIG.Input_Depth 512 \
  CONFIG.Performance_Options First_Word_Fall_Through \
  CONFIG.Programmable_Full_Type Single_Programmable_Full_Threshold_Constant \
  CONFIG.Use_Embedded_Registers false \
] [get_bd_cells ReturnPacketsFIFO]
create_bd_cell -type module -reference CDC_EthernetController_NetPktProcessor CDC_EthernetController0
create_bd_cell -type ip -vlnv xilinx.com:ip:fifo_generator:13.2 recv_pkt_header_fifo
set_property -dict [list \
  CONFIG.Fifo_Implementation Independent_Clocks_Builtin_FIFO \
  CONFIG.Full_Threshold_Assert_Value 509 \
  CONFIG.Input_Data_Width 32 \
  CONFIG.Input_Depth 512 \
  CONFIG.Performance_Options First_Word_Fall_Through \
  CONFIG.Programmable_Full_Type Single_Programmable_Full_Threshold_Constant \
  CONFIG.Read_Clock_Frequency 333 \
  CONFIG.Use_Embedded_Registers false \
  CONFIG.Write_Clock_Frequency 125 \
] [get_bd_cells recv_pkt_header_fifo]
create_bd_cell -type ip -vlnv xilinx.com:ip:fifo_generator:13.2 recv_pkt_data_fifo
set_property -dict [list \
  CONFIG.Fifo_Implementation Independent_Clocks_Block_RAM \
  CONFIG.Input_Data_Width 32 \
  CONFIG.Input_Depth 2048 \
  CONFIG.Performance_Options First_Word_Fall_Through \
  CONFIG.Programmable_Full_Type No_Programmable_Full_Threshold \
  CONFIG.Reset_Pin false \
  CONFIG.Use_Embedded_Registers false \
  CONFIG.Use_Extra_Logic false \
  CONFIG.Write_Data_Count true \
] [get_bd_cells recv_pkt_data_fifo]
create_bd_cell -type ip -vlnv xilinx.com:ip:fifo_generator:13.2 send_pkt_header_fifo
set_property -dict [list \
  CONFIG.Fifo_Implementation Independent_Clocks_Builtin_FIFO \
  CONFIG.Full_Threshold_Assert_Value 511 \
  CONFIG.Input_Data_Width 32 \
  CONFIG.Input_Depth 512 \
  CONFIG.Performance_Options First_Word_Fall_Through \
  CONFIG.Programmable_Full_Type Single_Programmable_Full_Threshold_Constant \
  CONFIG.Read_Clock_Frequency 125 \
  CONFIG.Use_Embedded_Registers false \
  CONFIG.Write_Clock_Frequency 333 \
] [get_bd_cells send_pkt_header_fifo]
create_bd_cell -type ip -vlnv xilinx.com:ip:fifo_generator:13.2 send_pkt_data_fifo
set_property -dict [list \
  CONFIG.Fifo_Implementation Independent_Clocks_Block_RAM \
  CONFIG.Input_Data_Width 32 \
  CONFIG.Input_Depth 2048 \
  CONFIG.Output_Data_Width 8 \
  CONFIG.Performance_Options First_Word_Fall_Through \
  CONFIG.Programmable_Full_Type No_Programmable_Full_Threshold \
  CONFIG.Reset_Pin false \
  CONFIG.Use_Embedded_Registers false \
  CONFIG.Use_Extra_Logic false \
  CONFIG.Write_Data_Count true \
  CONFIG.asymmetric_port_width true \
] [get_bd_cells send_pkt_data_fifo]
create_bd_cell -type inline_hdl -vlnv xilinx.com:inline_hdl:ilconstant:1.0 DoNotReset
set_property -dict {CONFIG.CONST_VAL 0} [get_bd_cells DoNotReset]
create_bd_cell -type ip -vlnv xilinx.com:ip:blk_mem_gen:8.4 pkt_recv_scratch_mem
set_property -dict [list \
  CONFIG.Memory_Type Simple_Dual_Port_RAM \
  CONFIG.Register_PortB_Output_of_Memory_Primitives false \
  CONFIG.Write_Depth_A 2048 \
  CONFIG.Write_Width_A 8 \
  CONFIG.Write_Width_B 32 \
  CONFIG.use_bram_block Stand_Alone \
] [get_bd_cells pkt_recv_scratch_mem]
create_bd_cell -type module -reference EthernetController3 EthernetController3_0
set_property -dict [list \
  CONFIG.DEVICE_IPv4_ADDRESS_OCTET_0 0xC0 \
  CONFIG.DEVICE_IPv4_ADDRESS_OCTET_1 0xA8 \
  CONFIG.DEVICE_IPv4_ADDRESS_OCTET_2 0x01 \
  CONFIG.DEVICE_IPv4_ADDRESS_OCTET_3 0xAB \
  CONFIG.DEVICE_MAC_ADDRESS_OCTET_0 0x00 \
  CONFIG.DEVICE_MAC_ADDRESS_OCTET_1 0x0A \
  CONFIG.DEVICE_MAC_ADDRESS_OCTET_2 0x35 \
  CONFIG.DEVICE_MAC_ADDRESS_OCTET_3 0x03 \
  CONFIG.DEVICE_MAC_ADDRESS_OCTET_4 0x78 \
  CONFIG.DEVICE_MAC_ADDRESS_OCTET_5 0xF1 \
  CONFIG.PAYLOAD_MAGIC_HEADER_BYTE 0xA5 \
] [get_bd_cells EthernetController3_0]
create_bd_cell -type ip -vlnv xilinx.com:ip:gig_ethernet_pcs_pma:17.0 gig_ethernet_pcs_pma_0
set_property -dict [list \
  CONFIG.DIFFCLK_BOARD_INTERFACE sgmii_phyclk \
  CONFIG.ETHERNET_BOARD_INTERFACE sgmii_lvds \
  CONFIG.MDIO_BOARD_INTERFACE mdio_mdc \
  CONFIG.NumOfLanes 1 \
  CONFIG.TxLane0_Placement DIFF_PAIR_2 \
  CONFIG.Tx_In_Upper_Nibble 0 \
  CONFIG.USE_BOARD_FLOW true \
] [get_bd_cells gig_ethernet_pcs_pma_0]
create_bd_cell -type module -reference CDC_MDIOController_EthernetController CDC_MDIO_Ethernet_0
